# EAGLE design WeBee (EAGLE 7.1.0)

## Sheet 1 of 4
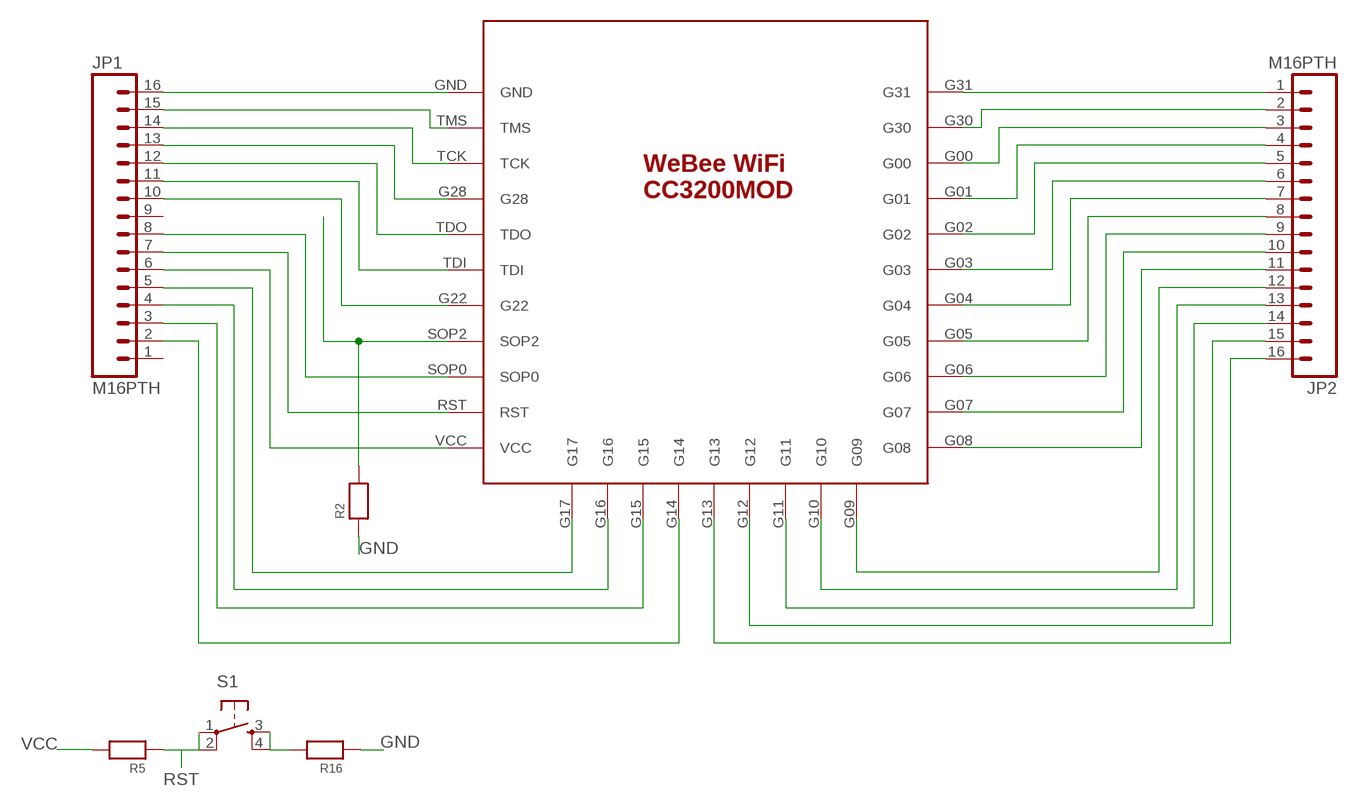
[diagram p0: schematic, sheet 1]

### Parts
JP1  M16PTH  [1X16]
JP2  M16PTH  [1X16]
R2  RESISTOR0402  [0402]
R5  RESISTOR0402  [0402]
R16  RESISTOR0402  [0402]
S1  TAC_SWITCHSMD  [TACTILE_SWITCH_SMD]
U$1  WEBEE_WIFI_CC3200  [CC3200]

### Nets
FTDI_RX: JP2.4 U$1.G01 ; also sheet 4
FTDI_TX: JP2.5 U$1.G02 ; also sheet 4
G00: JP2.3 U$1.G00
GND [vcc]: JP1.16 R2.1 R16.1 U$1.GND ; also sheet 2,3,4
N$1: R16.2 S1.3 S1.4
N$2: JP1.15 U$1.TMS
N$3: JP1.14 U$1.TCK
N$4: JP1.13 U$1.G28
N$5: JP1.12 U$1.TDO
N$6: JP1.11 U$1.TDI
N$7: JP1.10 U$1.G22
N$9: JP1.8 U$1.SOP0
N$12: JP2.1 U$1.G31
N$13: JP2.2 U$1.G30
N$17: JP2.6 U$1.G03
N$18: JP2.7 U$1.G04
N$19: JP2.8 U$1.G05
N$20: JP2.9 U$1.G06
N$21: JP2.10 U$1.G07
N$22: JP2.11 U$1.G08
N$23: JP2.12 U$1.G09
N$24: JP1.5 U$1.G17
N$25: JP2.13 U$1.G10
N$26: JP2.14 U$1.G11
N$27: JP2.15 U$1.G12
N$28: JP2.16 U$1.G13
N$29: JP1.4 U$1.G16
N$30: JP1.3 U$1.G15
N$31: JP1.2 U$1.G14
RST: JP1.7 R5.1 S1.2 U$1.RST ; also sheet 4
SOP2: R2.2 U$1.SOP2 ; also sheet 4
VCC: JP1.6 R5.2 U$1.VCC ; also sheet 3,4
Unconnected: JP1.1 JP1.9 S1.1

## Sheet 2 of 4
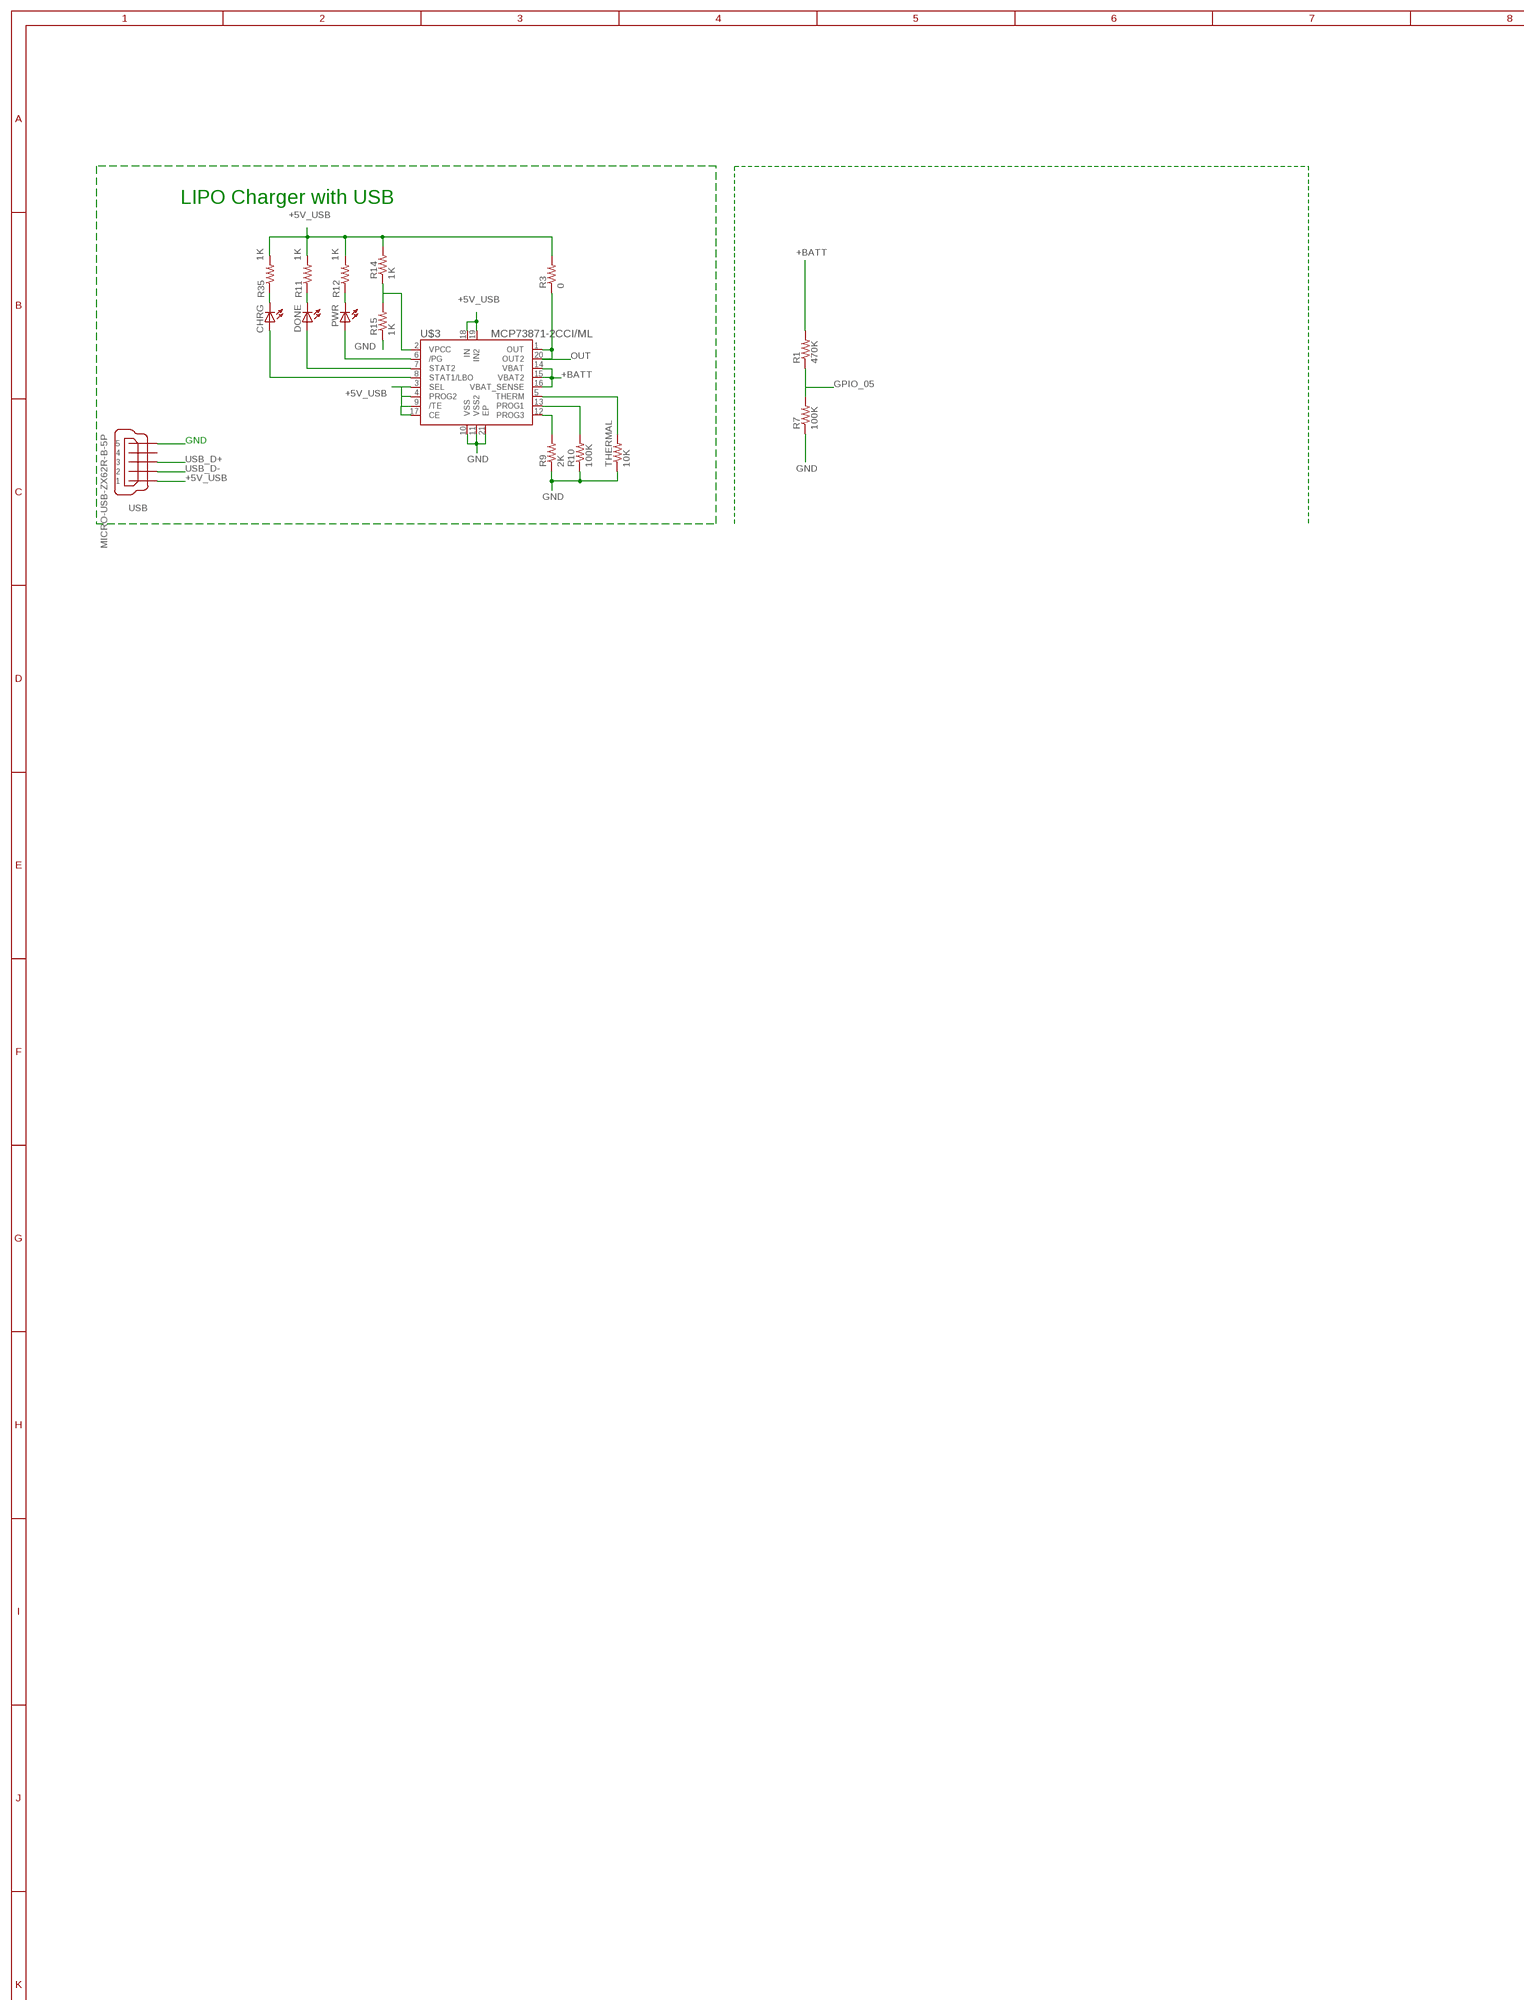
[diagram p1: schematic, sheet 2, part 1 of 3]
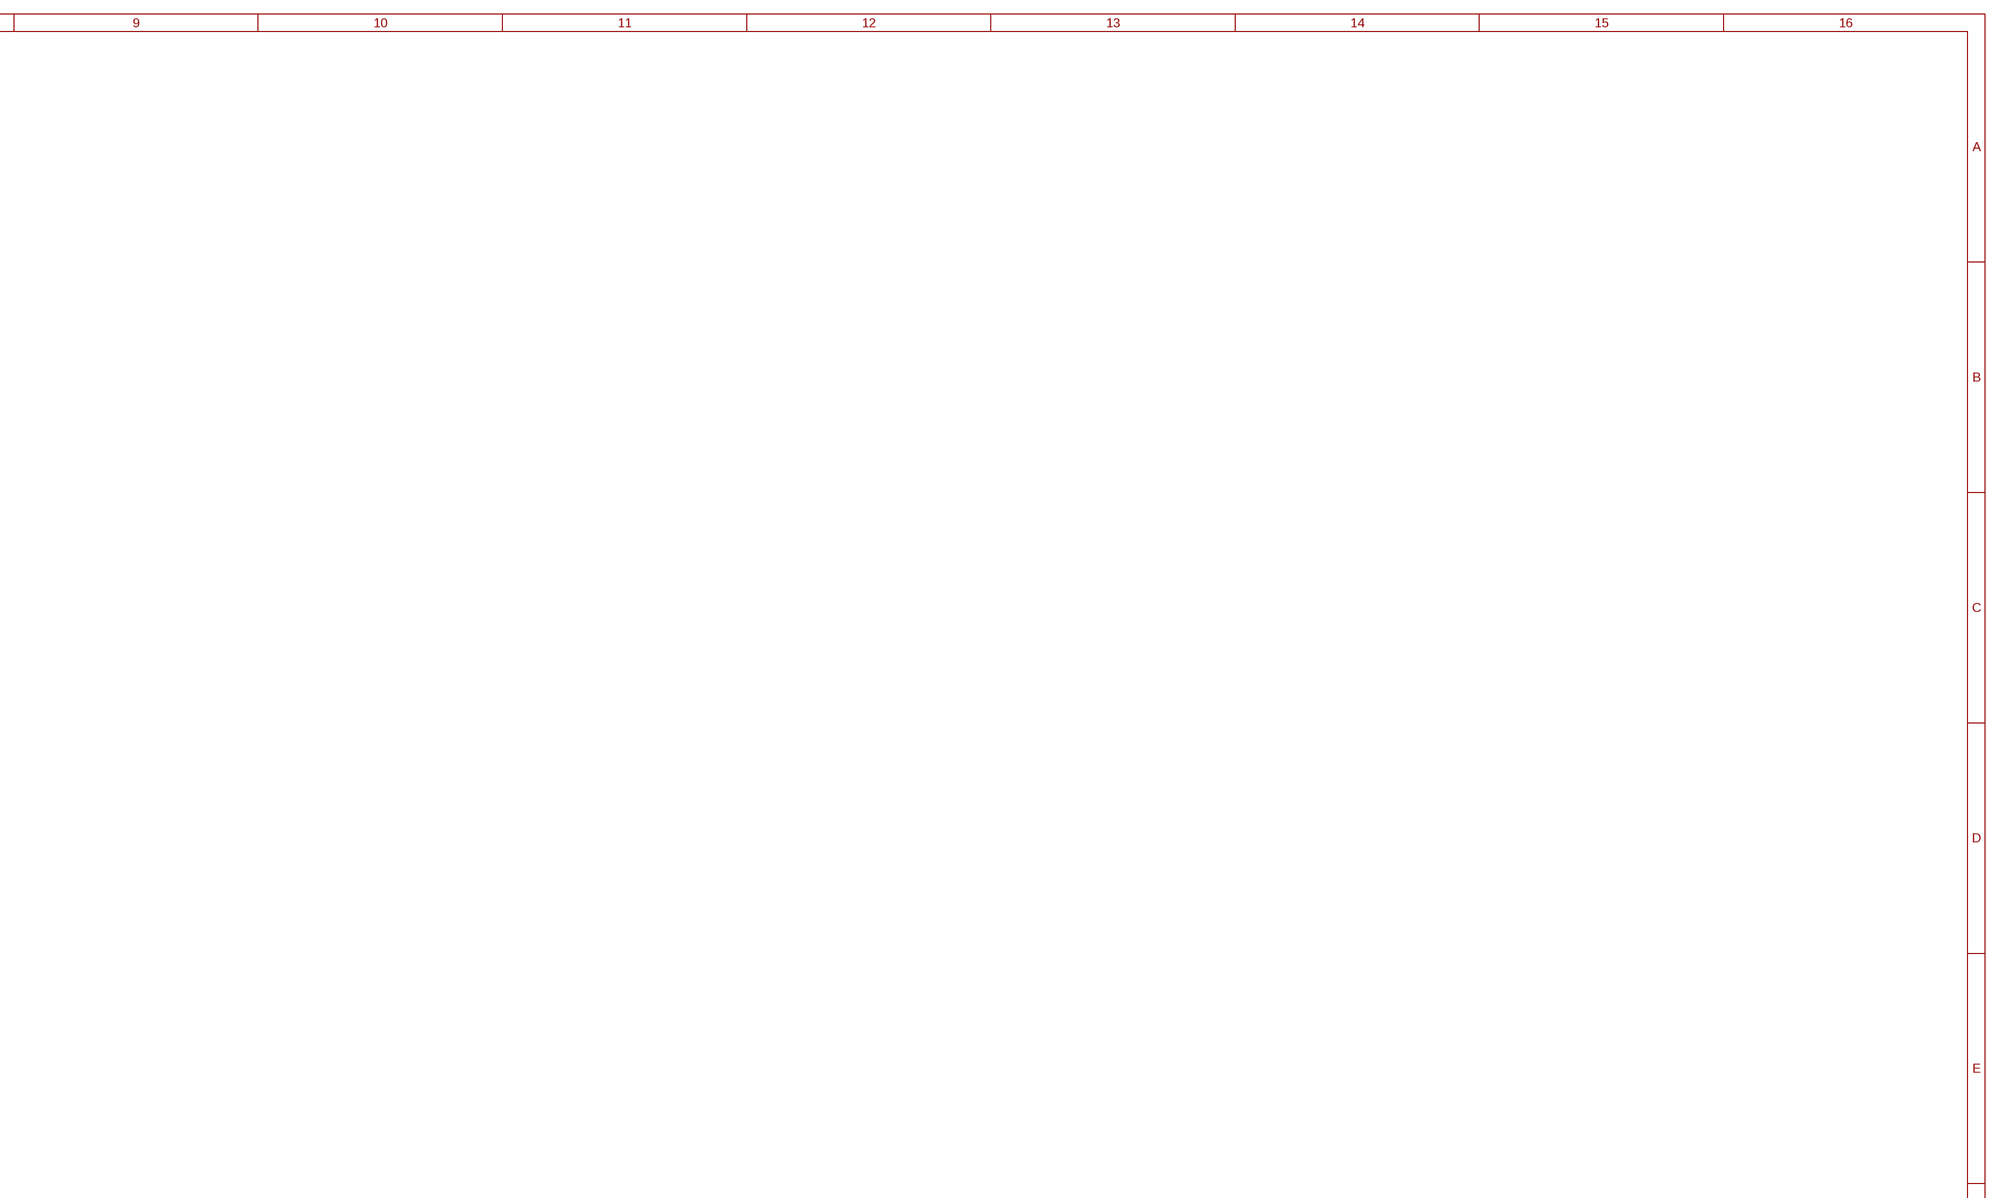
[diagram p2: schematic, sheet 2, part 2 of 3]
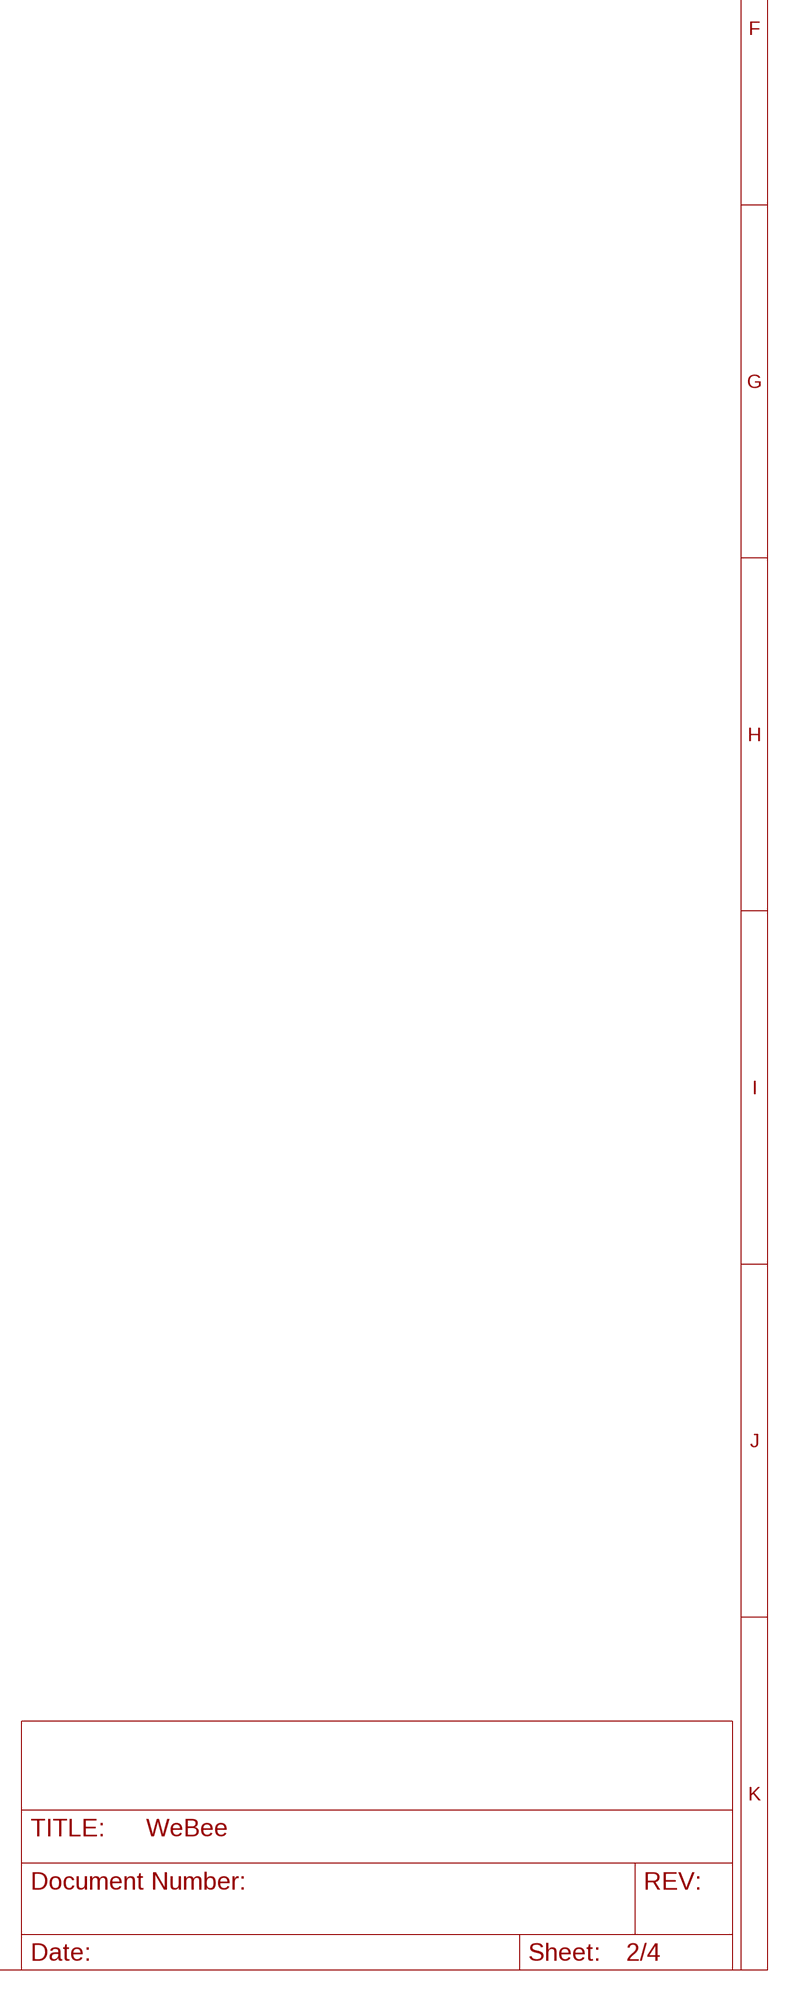
[diagram p3: schematic, sheet 2, part 3 of 3]

### Parts
CHRG  LEDSML0603  [SML0603]
DONE  LEDSML0603  [SML0603]
PWR  LEDSML0603  [SML0603]
R1  470K  RESISTOR0603  [0603-RES]
R3  0  RESISTOR0603-RES  [0603-RES]
R7  100K  RESISTOR0603  [0603-RES]
R9  2K  RESISTOR0603-RES  [0603-RES]
R10  100K  RESISTOR0603-RES  [0603-RES]
R11  1K  RESISTOR0402-RES  [0402-RES]
R12  1K  RESISTOR0402-RES  [0402-RES]
R14  1K  RESISTOR0603-RES  [0603-RES]
R15  1K  RESISTOR0603-RES  [0603-RES]
R35  1K  RESISTOR0402-RES  [0402-RES]
THERMAL  10K  RESISTOR0603-RES  [0603-RES]
U$3  MCP73871-2CCI/ML  [QFN20-4X4]
USB  MICRO-USB-ZX62R-B-5P  [ZX62R-B-5P]

### Nets
+5V_USB: R3.2 R11.2 R12.2 R14.2 R35.2 U$3.3(SEL) U$3.4(PROG2) U$3.9(/TE) U$3.17(CE) U$3.18(IN) U$3.19(IN2) USB.1 ; also sheet 4
+BATT: R1.2 U$3.14(VBAT) U$3.15(VBAT2) U$3.16(VBAT_SENSE) ; also sheet 3
GND [vcc]: R7.1 R9.1 R10.1 R15.1 THERMAL.1 U$3.10(VSS) U$3.11(VSS2) U$3.21(EP) USB.5 ; also sheet 1,3,4
GPIO_05: R1.1 R7.2
N$68: R9.2 U$3.12(PROG3)
N$69: R10.2 U$3.13(PROG1)
N$70: PWR.A U$3.6(/PG)
N$71: DONE.A U$3.7(STAT2)
N$72: CHRG.A U$3.8(STAT1/LBO)
N$73: CHRG.C R35.1
N$74: DONE.C R11.1
N$75: PWR.C R12.1
N$76: R14.1 R15.2 U$3.2(VPCC)
N$77: THERMAL.2 U$3.5(THERM)
OUT: R3.1 U$3.1(OUT) U$3.20(OUT2) ; also sheet 3
USB_D+: USB.3 ; also sheet 4
USB_D-: USB.2 ; also sheet 4
Unconnected: USB.4

### Notes on the sheet
- LIPO Charger with USB
- GND

## Sheet 3 of 4
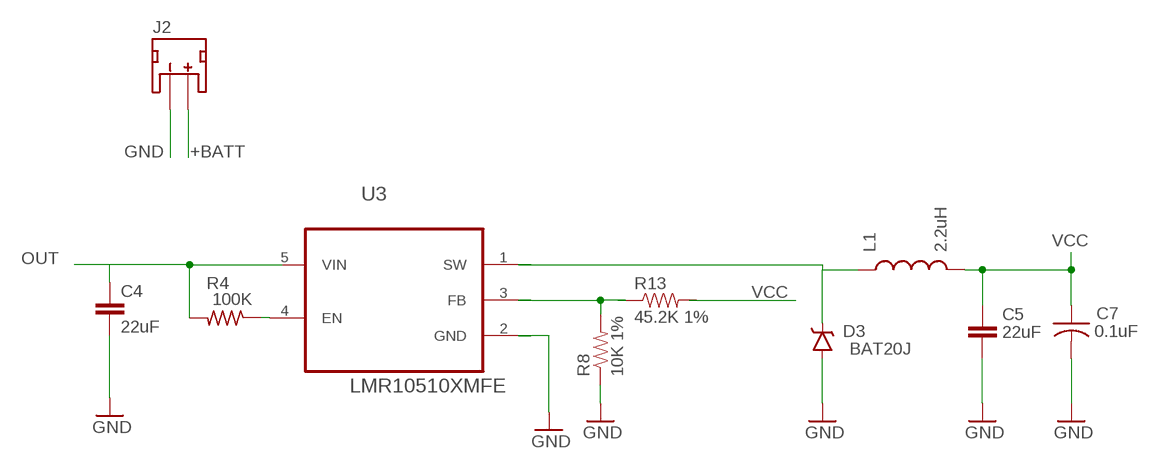
[diagram p4: schematic, sheet 3]

### Parts
C4  22uF  C-EUC0603  [C0603]
C5  22uF  C-EUC0603  [C0603]
C7  0.1uF  C-USC0402  [C0402]
D3  BAT20J  DIODE-SCHOTTKY-BAT20J  [SOD-323]
J2  JST_2MM_MALE  [JST-2-SMD]
L1  2.2uH  INDUCTOR-SPARKFUN0805  [0805]
R4  100K  R-US_R0402  [R0402]
R8  10K 1%  RESISTOR0402-RES  [0402-RES]
R13  45.2K 1%  RESISTOR0402-RES  [0402-RES]
U3  LMR10510XMFE  [SOT95P270X145-5N]

### Nets
+BATT: J2.2(+) ; also sheet 2
FB: R8.2 R13.1 U3.3(FB)
GND [vcc]: C4.2 C5.2 C7.2 D3.A J2.1(-) R8.1 U3.2(GND) ; also sheet 1,2,4
N$11: R4.1 U3.4(EN)
OUT: C4.1 R4.2 U3.5(VIN) ; also sheet 2
SW: D3.C L1.1 U3.1(SW)
VCC: C5.1 C7.1 L1.2 R13.2 ; also sheet 1,4
Unconnected: J2.NC1(PAD1) J2.NC2(PAD2)

## Sheet 4 of 4
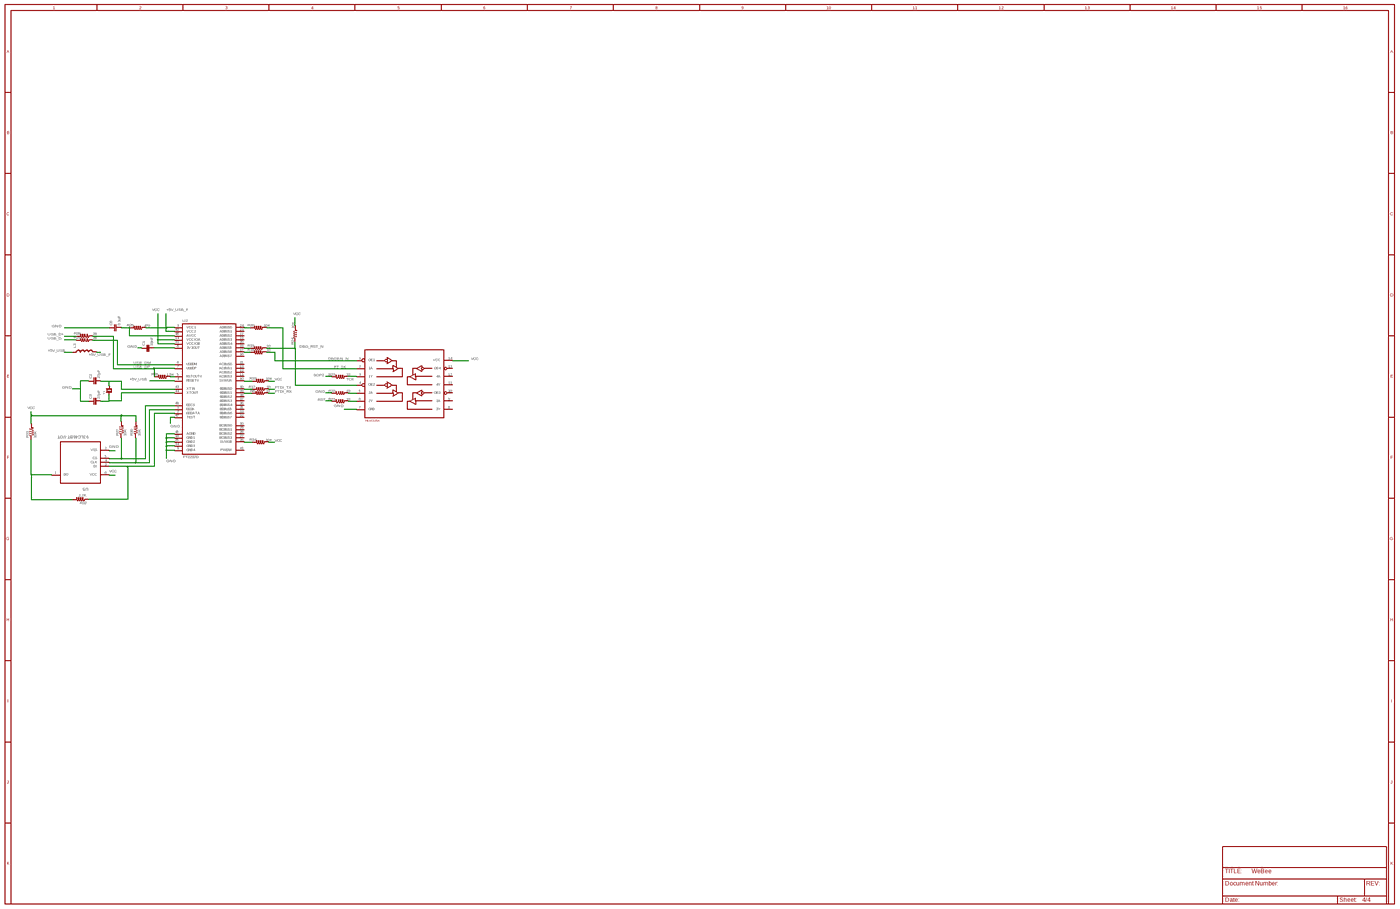
[diagram p5: schematic, sheet 4, overview]
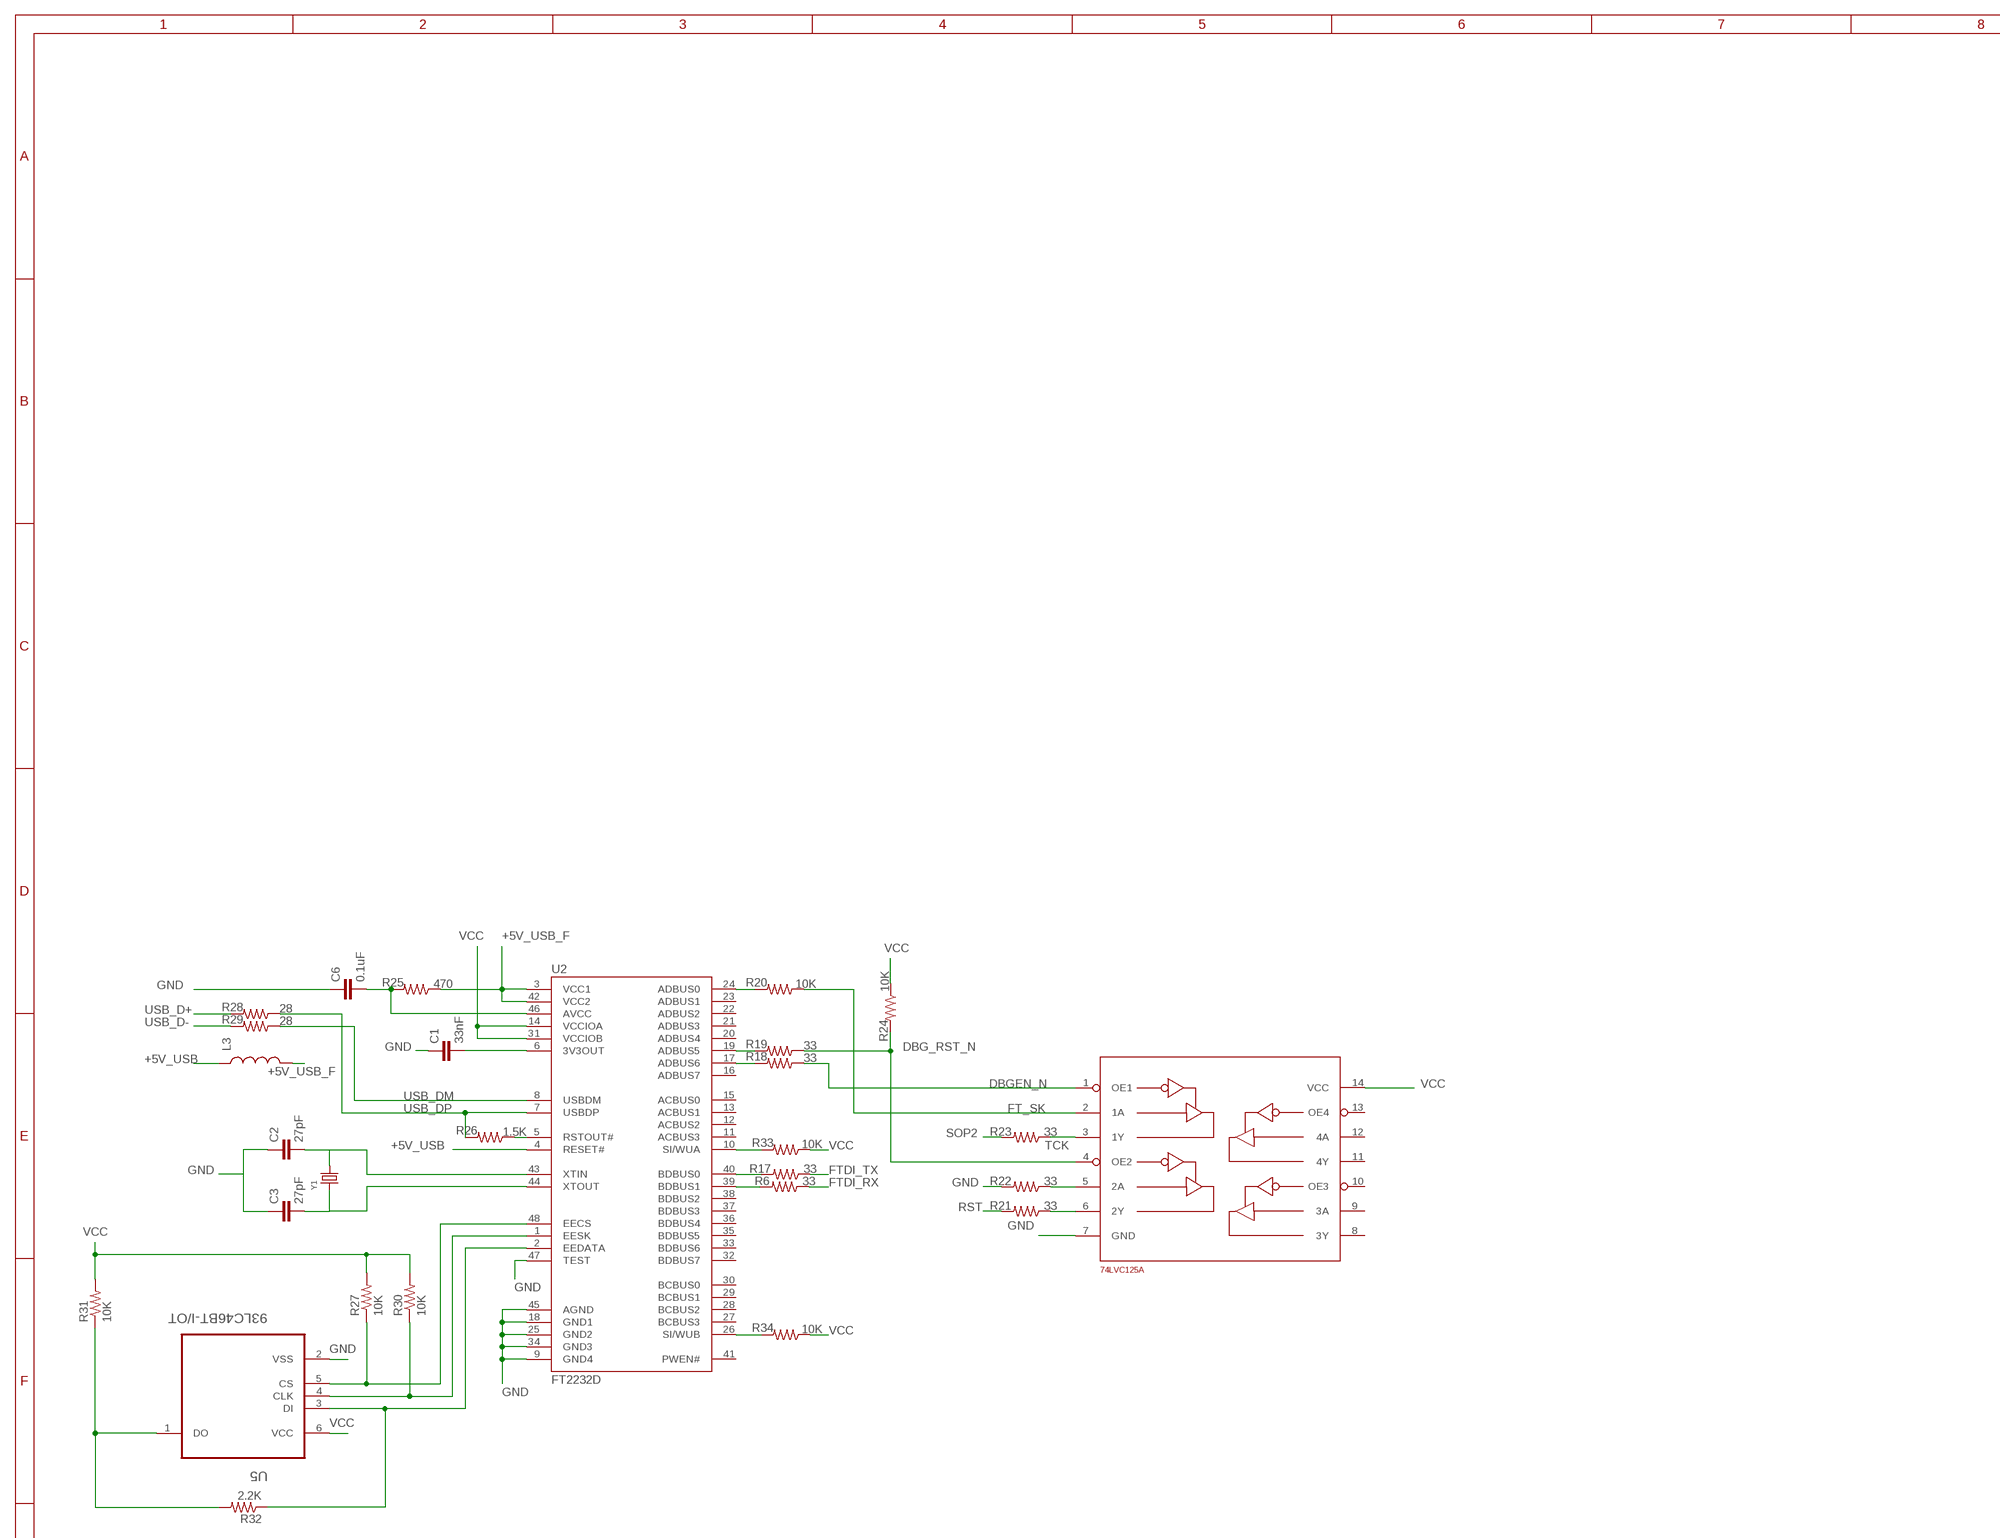
[diagram p6: schematic, sheet 4, part 1 of 4]
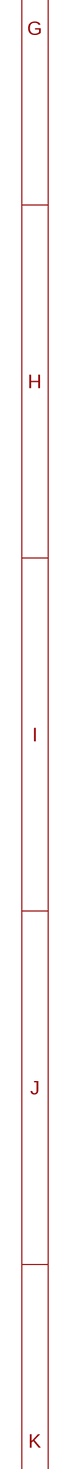
[diagram p7: schematic, sheet 4, part 2 of 4]
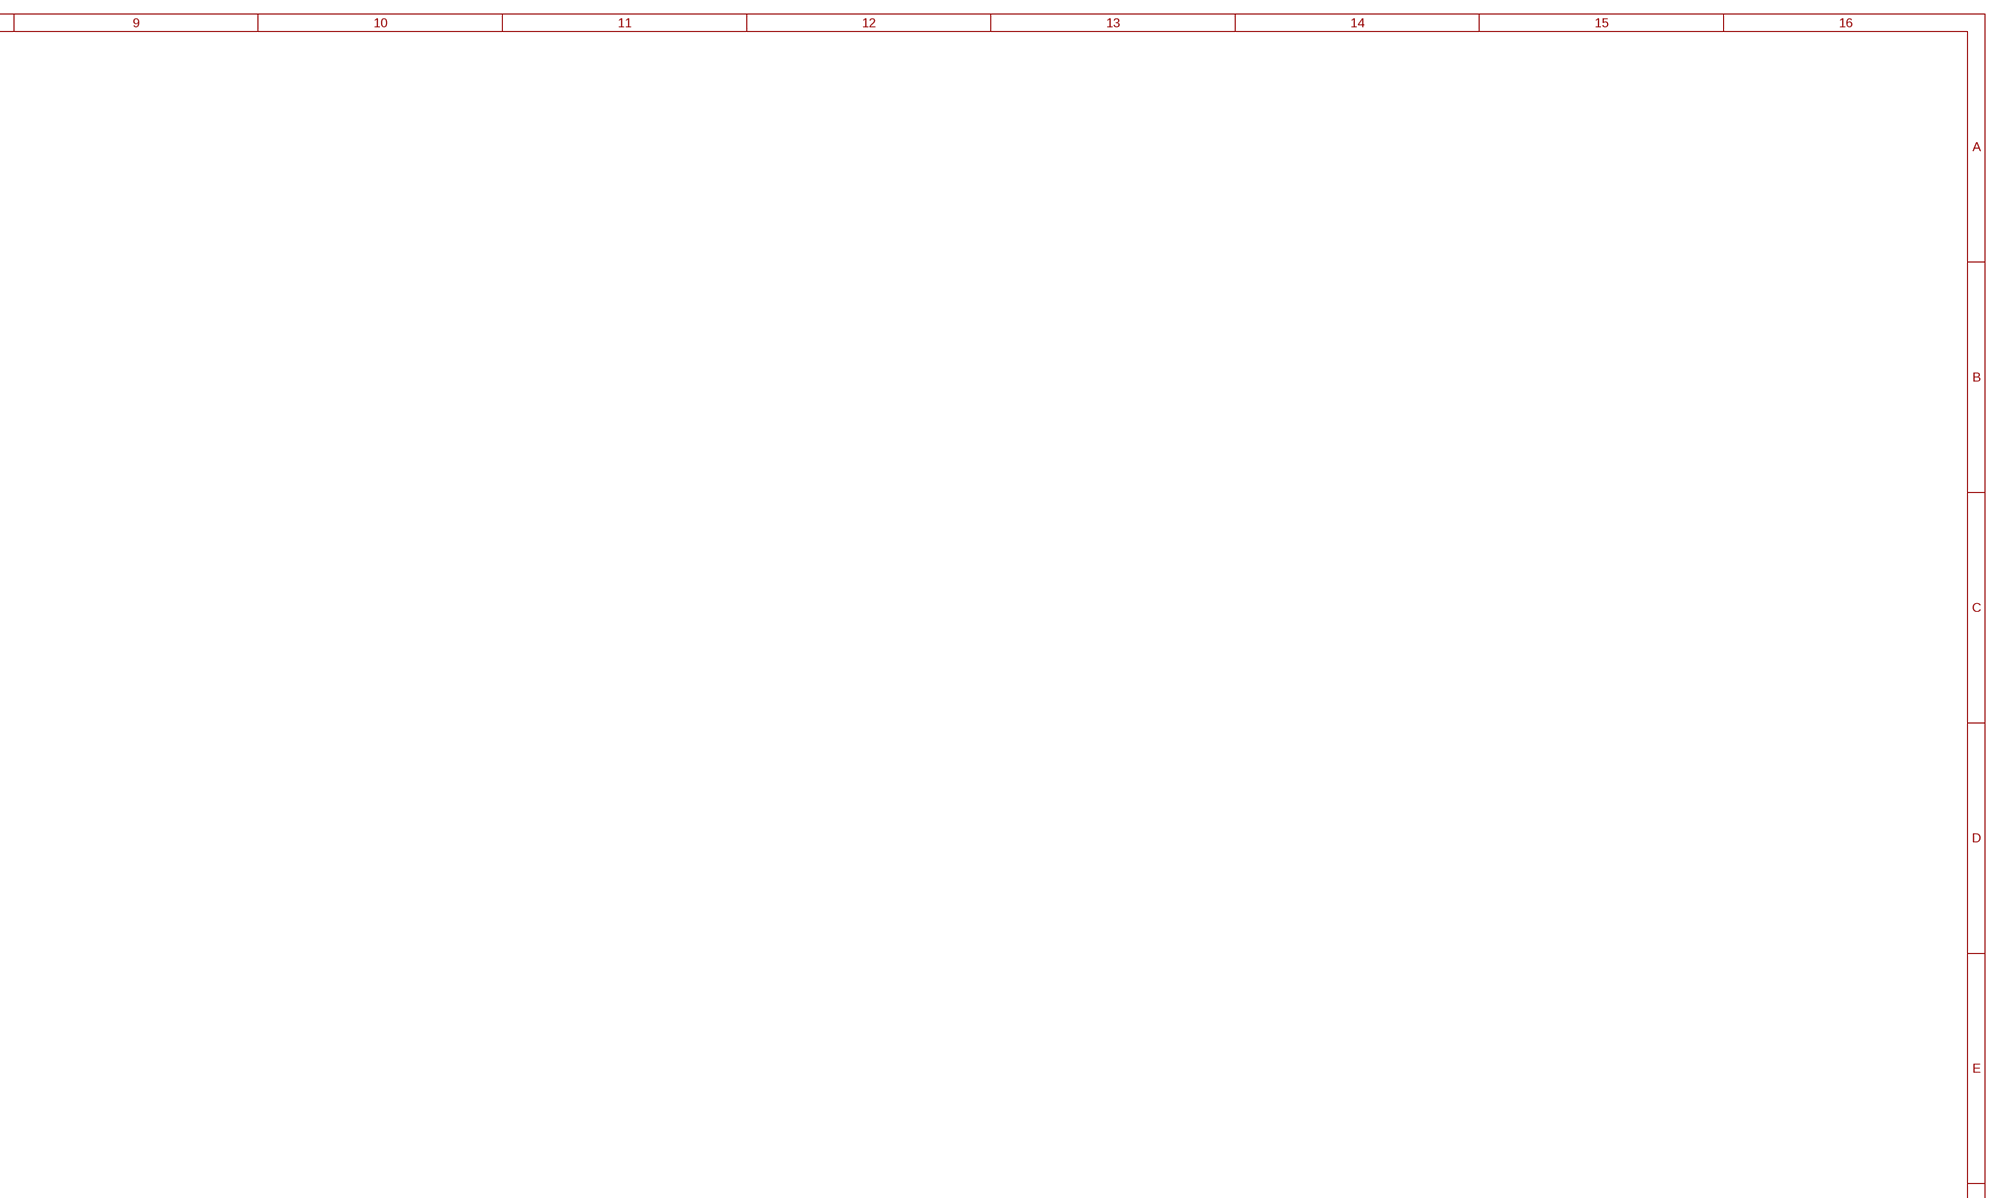
[diagram p8: schematic, sheet 4, part 3 of 4]
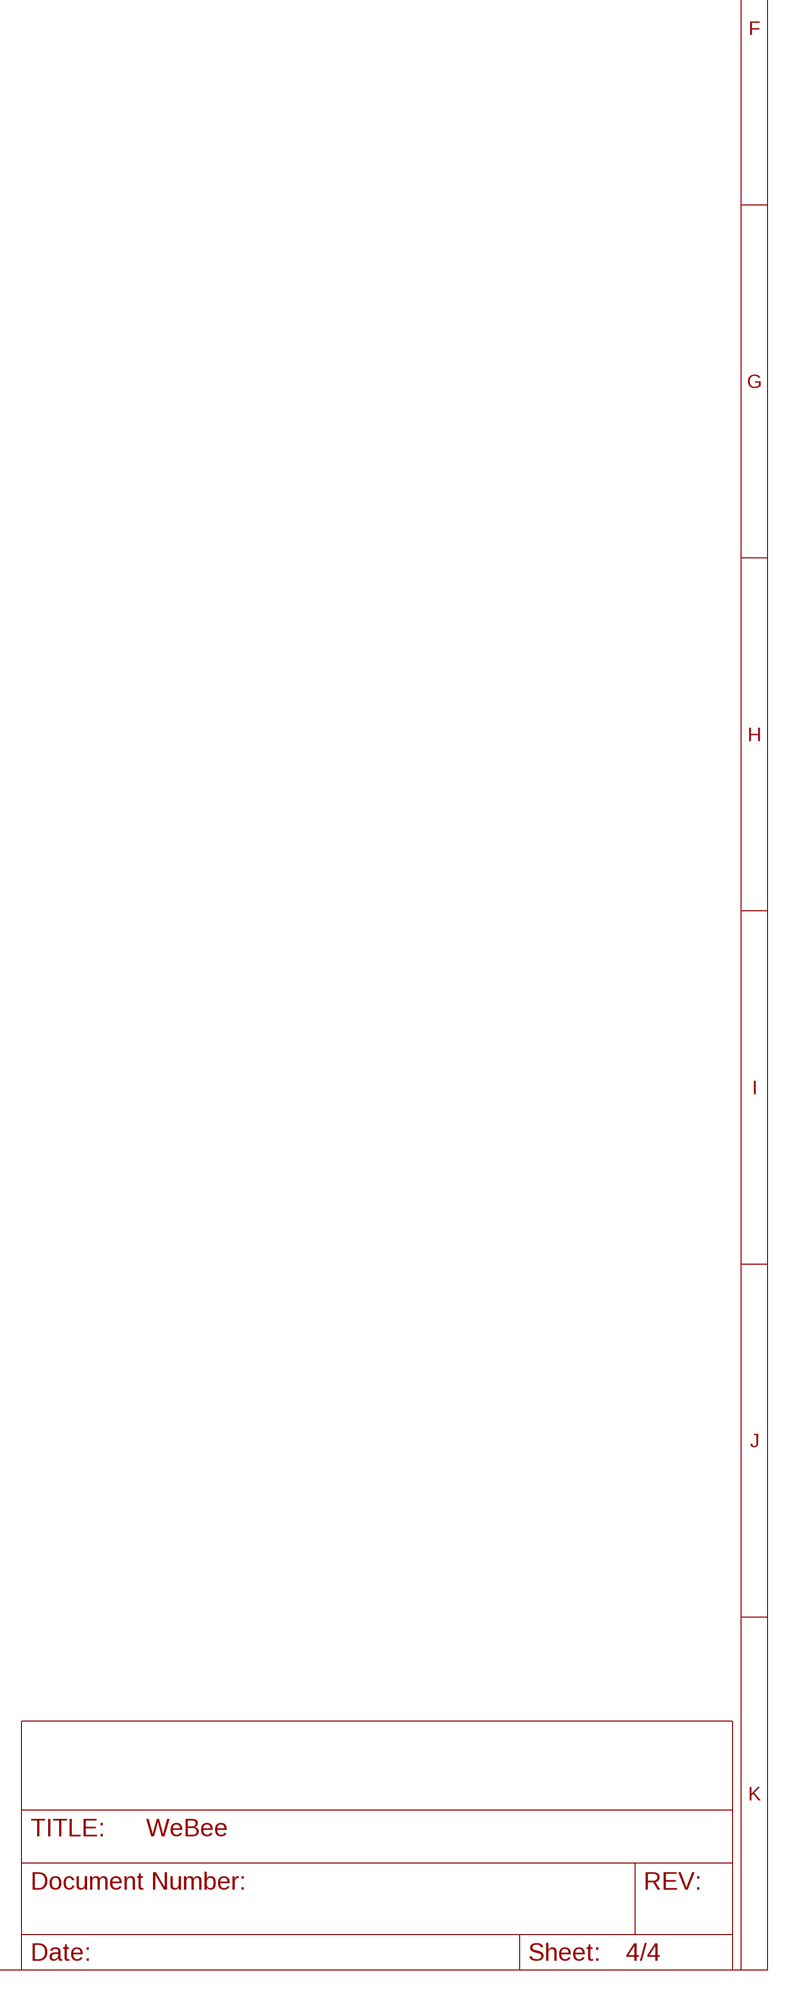
[diagram p9: schematic, sheet 4, part 4 of 4]

### Parts
C1  33nF  CAP0402-CAP  [0402-CAP]
C2  27pF  CAP0402-CAP  [0402-CAP]
C3  27pF  CAP0402-CAP  [0402-CAP]
C6  0.1uF  CAP0402-CAP  [0402-CAP]
L3  INDUCTOR-SPARKFUN0603  [0603]
R6  33  RESISTOR0402-RES  [0402-RES]
R17  33  RESISTOR0402-RES  [0402-RES]
R18  33  RESISTOR0402-RES  [0402-RES]
R19  33  RESISTOR0402-RES  [0402-RES]
R20  10K  RESISTOR0402-RES  [0402-RES]
R21  33  RESISTOR0402-RES  [0402-RES]
R22  33  RESISTOR0402-RES  [0402-RES]
R23  33  RESISTOR0402-RES  [0402-RES]
R24  10K  RESISTOR0402-RES  [0402-RES]
R25  470  RESISTOR0402-RES  [0402-RES]
R26  1.5K  RESISTOR0402-RES  [0402-RES]
R27  10K  RESISTOR0402-RES  [0402-RES]
R28  28  RESISTOR0402-RES  [0402-RES]
R29  28  RESISTOR0402-RES  [0402-RES]
R30  10K  RESISTOR0402-RES  [0402-RES]
R31  10K  RESISTOR0402-RES  [0402-RES]
R32  2.2K  RESISTOR0402-RES  [0402-RES]
R33  10K  RESISTOR0402-RES  [0402-RES]
R34  10K  RESISTOR0402-RES  [0402-RES]
U2  FT2232D  [LQFP-48]
U5  93LC46BT-I/OT  [SOT95P280X145-6N]
U$4  DECADE-74LVC125A  [DECADE-SO-14]
Y1  CRYSTAL2.5X2.0MM  [CRYSTAL_2.5X2]

### Nets
+5V_USB: L3.1 U2.4(RESET#) ; also sheet 2
+5V_USB_F: L3.2 R25.1 U2.3(VCC1) U2.42(VCC2)
DBG_RST_N: R19.1 R24.2 U$4.4(OE2)
DBGEN_N: R18.1 U$4.1(OE1)
FT_SK: R20.1 U$4.2(1A)
FTDI_RX: R6.1 ; also sheet 1
FTDI_TX: R17.1 ; also sheet 1
GND [vcc]: C1.1 C2.1 C3.1 C6.1 R22.2 U2.9(GND4) U2.18(GND1) U2.25(GND2) U2.34(GND3) U2.45(AGND) U2.47(TEST) U5.2(VSS) U$4.7(GND) ; also sheet 1,2,3
N$8: R26.1 U2.5(RSTOUT#)
N$38: C2.2 U2.43(XTIN) Y1.3
N$39: R27.1 U2.48(EECS) U5.5(CS)
N$40: C3.2 U2.44(XTOUT) Y1.1
N$41: R30.1 U2.1(EESK) U5.4(CLK)
N$42: R32.1 U2.2(EEDATA) U5.3(DI)
N$43: C1.2 U2.6(3V3OUT)
N$44: R17.2 U2.40(BDBUS0)
N$45: R6.2 U2.39(BDBUS1)
N$46: R20.2 U2.24(ADBUS0)
N$47: R19.2 U2.19(ADBUS5)
N$48: R18.2 U2.17(ADBUS6)
N$49: R22.1 U$4.5(2A)
N$50: R21.1 U$4.6(2Y)
N$51: C6.2 R25.2 U2.46(AVCC)
N$54: R31.1 R32.2 U5.1(DO)
N$55: R33.2 U2.10(SI/WUA)
N$56: R34.2 U2.26(SI/WUB)
RST: R21.2 ; also sheet 1
SOP2: R23.2 ; also sheet 1
TCK: R23.1 U$4.3(1Y)
USB_D+: R28.2 ; also sheet 2
USB_D-: R29.2 ; also sheet 2
USB_DM: R29.1 U2.8(USBDM)
USB_DP: R26.2 R28.1 U2.7(USBDP)
VCC: R24.1 R27.2 R30.2 R31.2 R33.1 U2.14(VCCIOA) U2.31(VCCIOB) U5.6(VCC) U$4.14(VCC) ; also sheet 1,3
Unconnected: R34.1 U2.11(ACBUS3) U2.12(ACBUS2) U2.13(ACBUS1) U2.15(ACBUS0) U2.16(ADBUS7) U2.20(ADBUS4) U2.21(ADBUS3) U2.22(ADBUS2) U2.23(ADBUS1) U2.27(BCBUS3) U2.28(BCBUS2) U2.29(BCBUS1) U2.30(BCBUS0) U2.32(BDBUS7) U2.33(BDBUS6) U2.35(BDBUS5) U2.36(BDBUS4) U2.37(BDBUS3) U2.38(BDBUS2) U2.41(PWEN#) U$4.8(3Y) U$4.9(3A) U$4.10(OE3) U$4.11(4Y) U$4.12(4A) U$4.13(OE4)

## Library data of the parts
C1-C3 C6 = SparkFun-Passives:CAP: Capacitor Standard 0603 ceramic capacitor, and 0.1" leaded capacitor.
C4 C5 = rcl:C-EU: CAPACITOR, European symbol
C7 = adafruit:C-US: CAPACITOR, American symbol
CHRG DONE PWR = led:LED: LED OSRAM: - CHIPLED LG R971, LG N971, LY N971, LG Q971, LY Q971, LO R971, LY R971 LH N974, LH R974 LS Q976, LO Q976, LY Q976 LO Q996 - Hyper CHIPLED LW Q18S LB Q993, LB Q99A, LB R99A - SideLED LS A670, LO A670, LY A670, LG A670, LP A670 LB A673, LV A673, LT A673, LW A673 LH A674 LY A675 LS A676, LA A676, LO A676, LY A676, LW A676 LS A679, LY A679, LG A679 - Hyper Micro SIDELED® LS Y876, LA Y876, LO Y876, LY Y876 LT Y87S - SmartLED LW L88C, LW L88S LB L89C, LB L89S, LG L890 LS L89K, LO L89K, LY L89K LS L896, LA L896, LO L896, LY L896 - TOPLED LS T670, LO T670, LY T670, LG T670, LP T670 LSG T670, LSP T670, LSY T670, LOP T670, LYG T670 LG T671, LOG T671, LSG T671 LB T673, LV T673, LT T673, LW T673 LH T674 LS T676, LA T676, LO T676, LY T676, LB T676, LH T676, LSB T676, LW T676 LB T67C, LV T67C, LT T67C, LS T67K, LO T67K, LY T67K, LW E67C LS E67B, LA E67B, LO E67B, LY E67B, LB E67C, LV E67C, LT E67C LW T67C LS T679, LY T679, LG T679 LS T770, LO T770, LY T770, LG T770, LP T770 LB T773, LV T773, LT T773, LW T773 LH T774 LS E675, LA E675, LY E675, LS T675 LS T776, LA T776, LO T776, LY T776, LB T776 LHGB T686 LT T68C, LB T68C - Hyper Mini TOPLED® LB M676 - Mini TOPLED Santana® LG M470 LS M47K, LO M47K, LY M47K Source: http://www.osram.convergy.de LUXEON: - LUMILED® LXK2-PW12-R00, LXK2-PW12-S00, LXK2-PW14-U00, LXK2-PW14-V00 LXK2-PM12-R00, LXK2-PM12-S00, LXK2-PM14-U00 LXK2-PE12-Q00, LXK2-PE12-R00, LXK2-PE12-S00, LXK2-PE14-T00, LXK2-PE14-U00 LXK2-PB12-K00, LXK2-PB12-L00, LXK2-PB12-M00, LXK2-PB14-N00, LXK2-PB14-P00, LXK2-PB14-Q00 LXK2-PR12-L00, LXK2-PR12-M00, LXK2-PR14-Q00, LXK2-PR14-R00 LXK2-PD12-Q00, LXK2-PD12-R00, LXK2-PD12-S00 LXK2-PH12-R00, LXK2-PH12-S00 LXK2-PL12-P00, LXK2-PL12-Q00, LXK2-PL12-R00 Source: www.luxeon.com KINGBRIGHT: KA-3528ASYC Source: www.kingbright.com
D3 = SparkFun-DiscreteSemi:DIODE-SCHOTTKY: Schottky diodes in SFE's production catalog BAT20J 1A 23V 0.62Vf RB751 120mA 40V 0.37Vf PMEG4005EJ 0.5A 40V 0.42Vf MBRA140 1A 40V 0.5Vf B340A 3A 40V SMA; PROD_ID: DIO-11623
J2 = SparkFun-Connectors:JST_2MM_MALE: Mates to single-cell LiPo batteries. CONN-08352; PROD_ID: CONN-08352
JP1 JP2 = DECADE-libraries:M16: 1x16 .1" header
L1 L3 = Spark:INDUCTOR-SPARKFUN: Inductors Basic Inductor/Choke - 0603 and 1206. Footprints are not proven and vary greatly between part numbers. SRN6045- 33uH, 20% 1.4A
R1 R7 = SparkFun-Resistors:RESISTOR: Resistor Basic schematic elements and footprints for 0603, 1206, and PTH resistors.
R2 R5 R16 = microbuilder:RESISTOR: Resistors 0402 - 0402 Surface Mount Package 22 Ohm 1% 1/16W [Digikey: 311-22.0LRTR-ND] 33 Ohm 5% 1/16W 1.0K 5% 1/16W 1.5K 5% 1/16W 2.0K 1% 1/16W 10.0K 1% 1/16W [Digikey: 311-10.0KLRTR-ND] 10.0K 5% 1/16W [Digikey: RMCF0402JT10K0TR-ND] 12.1K 1% 1/16W [Digikey: 311-22.0LRTR-ND] 100.0K 5% 1/16W 0603 - 0603 Surface Mount Package 0 Ohm 1/10 Watt 1% Resistor 15 Ohm 1/10 Watt 1% Resistor 33 Ohm 1/10 Watt 1% Resistor 49.9 Ohm 1/10 Watt 1% Resistor 100 Ohm 1/10 Watt 1% Resistor 150 Ohm 1/10 Watt 1% Resistor 240 Ohm 1/10 Watt 1% Resistor 390 Ohm 1/10 Watt 1% Resistor 560 Ohm 1/10 Watt 1% Resistor 680 Ohm 1/10 Watt 1% Resistor 750 Ohm 1/10 Watt 1% Resistor 1.0K Ohm 1/10 Watt 1% Resistor 1.5K Ohm 1/10 Watt 1% Resistor 2.0K Ohm 1/10 Watt 1% Resistor 2.2K Ohm 1/10 Watt 1% Resistor 3.3K Ohm 1/10 Watt 1% Resistor 4.7K Ohm 1/10 Watt 1% Resistor 10.0K Ohm 1/10 Watt 1% Resistor 12.0K Ohm 1/10 Watt 1% Resistor 12.1K Ohm 1/10 Watt 1% Resistor 20.0K Ohm 1/10 Watt 1% Resistor 33.0K Ohm 1/10 Watt 1% Resistor 100.0K Ohm 1/10 Watt 1% Resistor 0805 - 0805 Surface Mount Package 0 Ohm 1/8 Watt 1% Resistor 33 Ohm 1/8 Watt 1% Resistor 100 Ohm 1/8 Watt 1% Resistor 150 Ohm 1/8 Watt 1% Resistor 200 Ohm 1/8 Watt 1% Resistor 240 Ohm 1/8 Watt 1% Resistor 330 Ohm 1/8 Watt 1% Resistor 390 Ohm 1/8 Watt 1% Resistor 470 Ohm 1/8 Watt 1% Resistor 1.0K Ohm 1/8 Watt 1% Resistor 1.5K Ohm 1/8 Watt 1% Resistor 2.0K Ohm 1/8 Watt 1% Resistor 4.7K Ohm 1/8 Watt 1% Resistor 5.1K Ohm 1/8 Watt 1% Resistor 5.6K Ohm 1/8 Watt 1% Resistor 10.0K Ohm 1/8 Watt 1% Resistor 22.0K Ohm 1/8 Watt 1% Resistor 33.0K Ohm 1/8 Watt 1% Resistor 100K Ohm 1/8 Watt 1% Resistor 1206 - 1206 Surface Mount Package 2012 - 2010 Surface Mount Package 0.11 Ohm 1/2 Watt 1% Resistor - Digikey: RHM.11UCT-ND
R3 R6 R8-R15 R17-R35 THERMAL = SparkFun-Passives:RESISTOR: Resistor Basic schematic elements and footprints for 0603, 1206, and PTH resistors.
R4 = adafruit:R-US_: RESISTOR, American symbol
S1 = Spark:TAC_SWITCH: SMD Tactiile Switch
U2 = SparkFun-DigitalIC:FT2232D: USB to USART/FIFO/JTAG/SPI/I2C
U3 = Microchip_By_element14_Batch_1:LMR10510XMFE
U5 = Microchip_By_element14_Batch_1:93LC46BT-I/OT: 1K Microwire Compatible Serial EEPROM; MPN: 93LC46BT-I/OT; OC_FARNELL: 1556164; OC_NEWARK: 75M3689; PACKAGE: SOT-6; SUPPLIER: Microchip
U$1 = WeeBee:WEBEE_WIFI_CC3200
U$3 = microchip-battery:MCP73871: Stand-Alone System Load Sharing and Li-Ion / Li-Polymer Battery Charge Managemen The MCP73871 device is a 1A fully integrated linear solution for system load sharing and Li-Ion / Li-Polymer battery charge management with AC-DC wall adapter and USB port power sources selection. It?s also capable of autonomous power source selection between input or battery. The MCP73871 device employs a constant current/constant voltage (CC/CV) charge algorithm with selectable charge termination point. The constant voltage regulation is fixed with four available options: 4.10V, 4.20V, 4.35V, or 4.40V.; LBO: 3.1 V; SAFETYTIMER: 6 Hours; VREG: 4.20V
U$4 = DECADE-libraries:DECADE-74LVC125A
USB = con-hirose:MICRO-USB-: Hirose Micro USB Connector ZX62R-B-5P: Micro B, reverse (top mount) shell SMT Supplier: DigiKey H11574CT-ND Source: http://www.hirose.co.jp/cataloge_hp/e24200011.pdf
Y1 = microbuilder:CRYSTAL: Crystals HC49UP - Surface Mount Crystal 4.0MHz 18pF +/-30ppm Surface Mount Crystal [Digikey: 535-9857-1-ND] 12.0 MHz Surface Mount Crystal [Digikey: 535-9869-6-ND] 25.0 MHz Surface Mount Crystal [Digikey: 535-9078-1-ND] 2.5 x 2.0mm - MEMs SMT Crystal 16.0 MHz 10pF 20ppm 2.5 x 2.0mm Crystal [Digikey -40-85°C: 535-10923-1-ND] 3.2 x 2.5mm - MEMs SMT Crystal 12.0 MHz 8pF 15ppm 3.2 x 2.5mm Crystal [Digikey: -10-70°C: 644-1047-1-ND -40-125°C: 644-1128-1-ND] 16.0 MHz 8pF 15ppm 3.2 x 2.5mm Crystal [Digikey: -10-70°C: 644-1049-1-ND -40-125°C: 644-1129-2-ND] 16.0 MHz 10pF 10ppm 3.2 x 2.5mm Crystal [Digikey: 644-1100-1-ND] 27.12 MHz 18pF 30ppm 3.2 x 2.5mm Crystal [Digikey: 887-1424-1-ND] 27.12MHz 10pF 10ppm 3.2 x 2.5mm Crystal [Digikey: 887-1329-1-ND] 4.9 x 1.8mm - MEMs SMT Crystal 32.768 KHz 12.5pF 20ppm 4.9 x 1.8mm Crystal [Digikey: SE2415CT-ND] 8.0 x 3.8mm - Surface Mount Crystal 32.768kHz 12.5pF 20ppm -40°C-85°C [Digikey: 535-9166-2-ND] Cylinder 32.768KHz Cylinder Crystal (2x6mm body) [Ex. Digikey: 300-8341-2-ND]

## Board
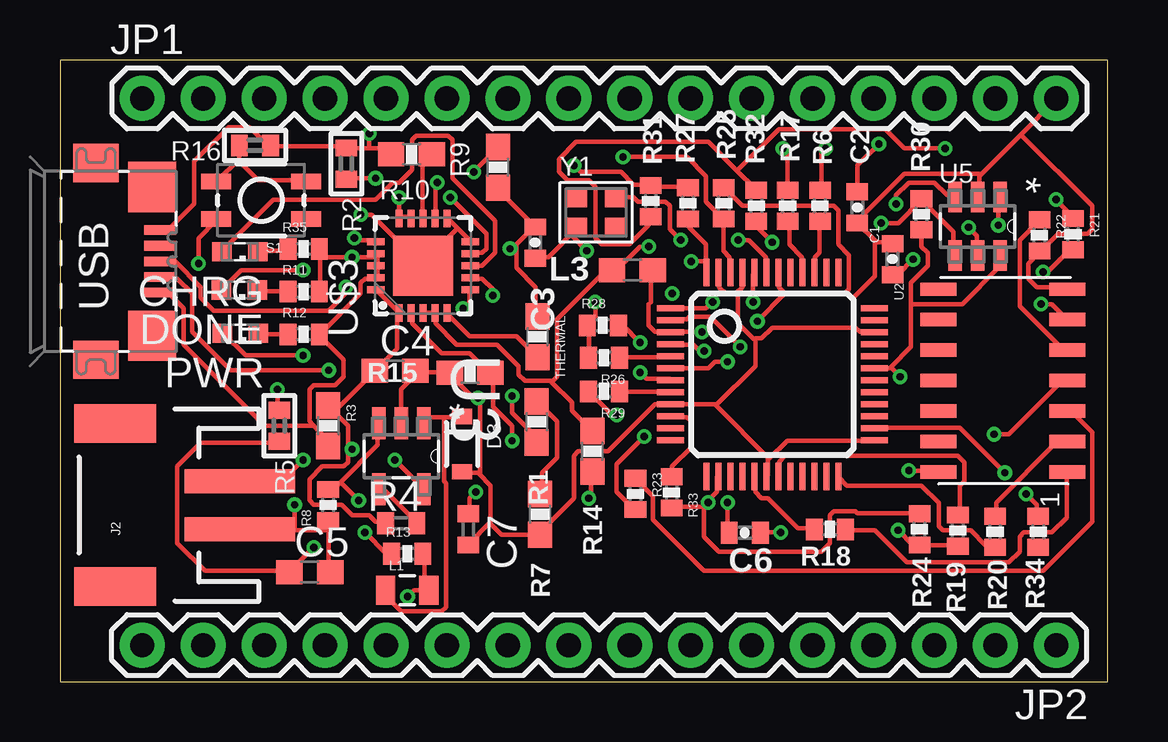
[diagram p10: board, top side]
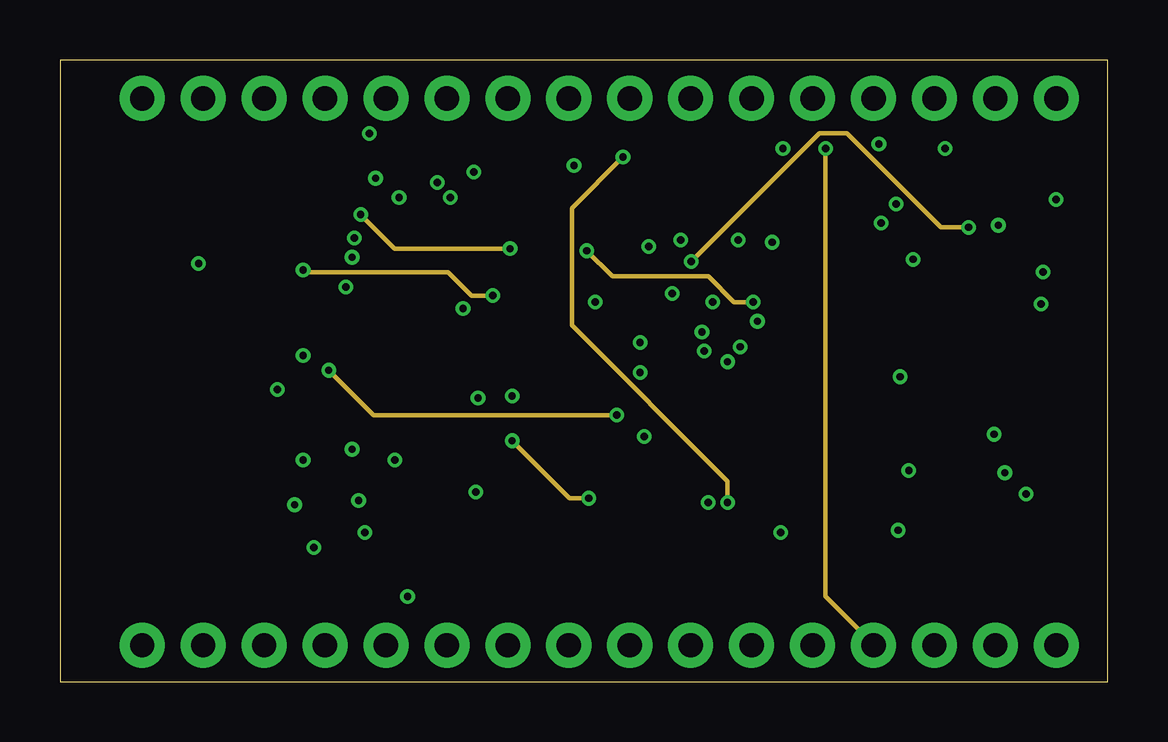
[diagram p11: board, inner layer Route2]
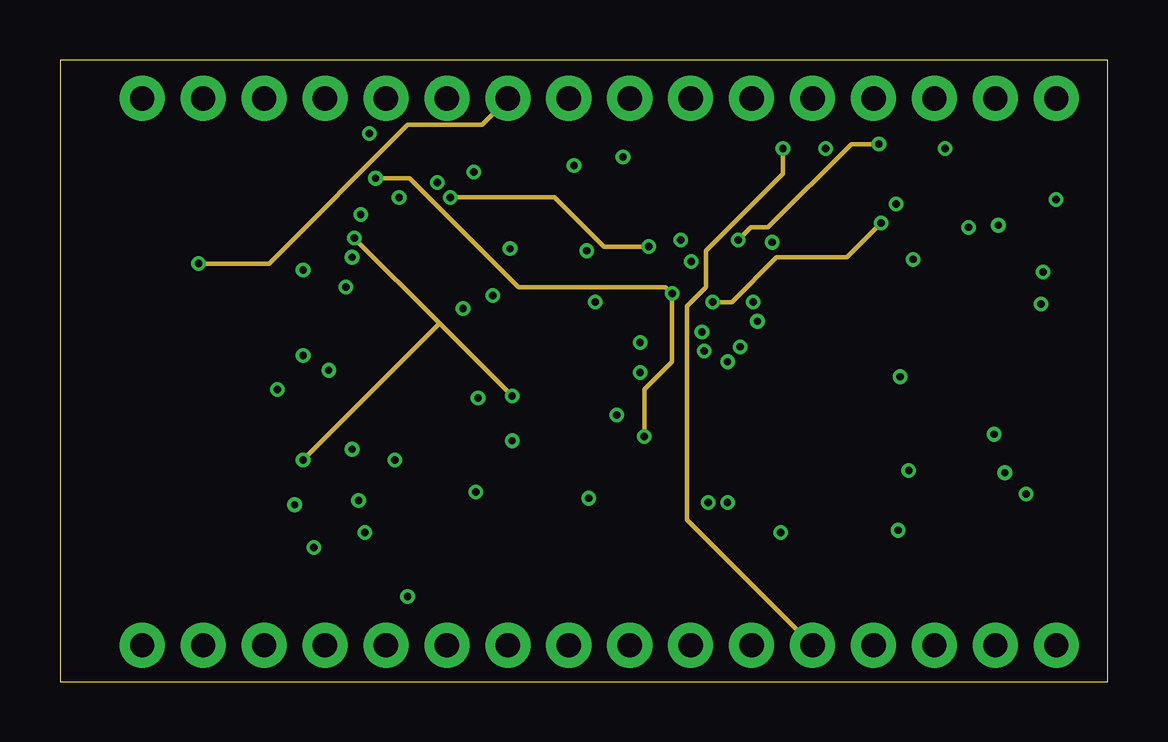
[diagram p12: board, inner layer Route15]
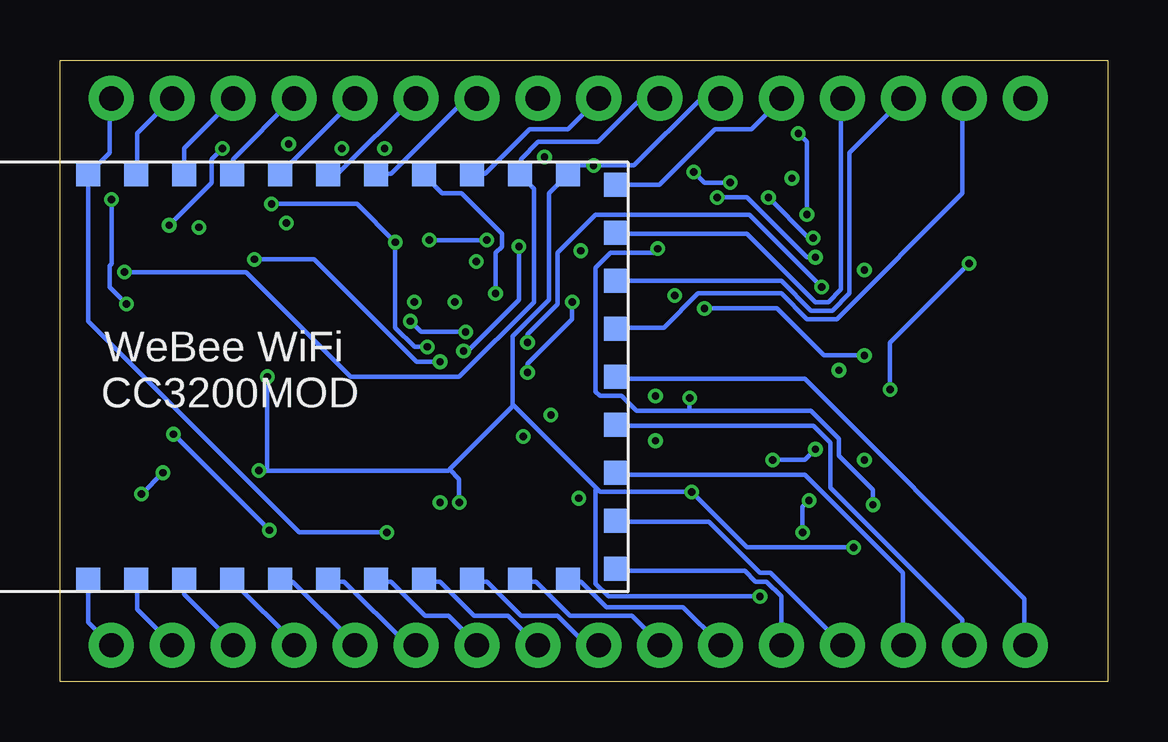
[diagram p13: board, bottom side, seen from below]

Size 43.67 x 25.91 mm. Coordinates in mm from the lower left corner, seen from the top.
Outline: 0,0 43.67,0 43.67,25.91 0,25.91 0,0
Copper layers (1*2*15*16): Top 0.035mm / dielectric 1.5mm / Route2 0.035mm / dielectric 0.15mm / Route15 0.035mm / dielectric 0.2mm / Bottom 0.035mm
Design rules "EagleRules *": minimum track width 7mil, minimum drill 12mil, track to track 7mil, track to pad 7mil, pad to pad 7mil, via to via 7mil, smd to smd 0mil, copper to edge 20mil, drill to drill 10mil, minimum pad ring 10mil, minimum via ring 6mil, stop-mask expansion 2mil, vias tented up to drill 25mil, thermal gap 10mil

### Footprints (pad centres in the part's own frame; a part is rotated, then mirrored left to right if it is on the bottom)
0402-CAP = smd 0.7 x 0.9: 1 -0.65,0; 2 0.65,0
C0603 = smd 1.1 x 1: 1 -0.85,0; 2 0.85,0
C0402 = smd 0.7 x 0.9: 1 -0.65,0; 2 0.65,0
SML0603 = smd 0.8 x 0.8: A 0.75,0; C -0.75,0
SOD-323 = smd 0.63 x 0.83: A 1.15,0; C -1.15,0
JST-2-SMD = smd 1 x 4.6: 1 -1,-3.7; 2 1,-3.7 | smd 1.6 x 3.4: NC1 -3.4,1.5; NC2 3.4,1.5
1X16 = drill 1.016 pad 1.88: 1 0,0; 2 2.54,0; 3 5.08,0; 4 7.62,0; 5 10.16,0; 6 12.7,0; 7 15.24,0; 8 17.78,0; 9 20.32,0; 10 22.86,0; 11 25.4,0; 12 27.94,0; 13 30.48,0; 14 33.02,0; 15 35.56,0; 16 38.1,0
0805 = smd 0.8 x 1.2: 1 -0.9,0; 2 0.9,0
0603 = smd 1.1 x 1: 1 -0.85,0; 2 0.85,0
0603-RES = smd 1.1 x 1: 1 -0.85,0; 2 0.85,0
0402 = smd 0.7 x 0.9: 1 -0.65,0; 2 0.65,0
R0402 = smd 0.7 x 0.9: 1 -0.65,0; 2 0.65,0
0402-RES = smd 0.7 x 0.9: 1 -0.65,0; 2 0.65,0
TACTILE_SWITCH_SMD = smd 1.25 x 0.65: 1 -1.875,0.775; 2 1.875,0.775; 3 -1.875,-0.775; 4 1.875,-0.775
LQFP-48 = smd 0.254 x 1.143: 1 -2.75,-4.25; 2 -2.25,-4.25; 3 -1.75,-4.25; 4 -1.25,-4.25; 5 -0.75,-4.25; 6 -0.25,-4.25; 7 0.25,-4.25; 8 0.75,-4.25; 9 1.25,-4.25; 10 1.75,-4.25; 11 2.25,-4.25; 12 2.75,-4.25; 25 2.75,4.25; 26 2.25,4.25; 27 1.75,4.25; 28 1.25,4.25; 29 0.75,4.25; 30 0.25,4.25; 31 -0.25,4.25; 32 -0.75,4.25; 33 -1.25,4.25; 34 -1.75,4.25; 35 -2.25,4.25; 36 -2.75,4.25 | smd 1.143 x 0.254: 13 4.25,-2.75; 14 4.25,-2.25; 15 4.25,-1.75; 16 4.25,-1.25; 17 4.25,-0.75; 18 4.25,-0.25; 19 4.25,0.25; 20 4.25,0.75; 21 4.25,1.25; 22 4.25,1.75; 23 4.25,2.25; 24 4.25,2.75; 37 -4.25,2.75; 38 -4.25,2.25; 39 -4.25,1.75; 40 -4.25,1.25; 41 -4.25,0.75; 42 -4.25,0.25; 43 -4.25,-0.25; 44 -4.25,-0.75; 45 -4.25,-1.25; 46 -4.25,-1.75; 47 -4.25,-2.25; 48 -4.25,-2.75
SOT95P270X145-5N = smd 1.321 x 0.559: 1 -1.372,0.94; 2 -1.372,0; 3 -1.372,-0.94; 4 1.372,-0.94; 5 1.372,0.94
SOT95P280X145-6N = smd 1.27 x 0.559: 1 -1.219,0.94; 2 -1.219,0; 3 -1.219,-0.94; 4 1.219,-0.94; 5 1.219,0; 6 1.219,0.94
CC3200 = smd 1 x 1: G00 -8.455,7; G01 -8.455,5; G02 -8.455,3; G03 -8.455,1; G04 -8.455,-1; G05 -8.455,-3; G06 -8.455,-5; G07 -8.455,-7; G08 -8.455,-9; G09 -8,-11; G10 -6,-11; G11 -4,-11; G12 -2,-11; G13 0,-11; G14 2,-11; G15 4,-11; G16 6,-11; G17 8,-11; G22 8.455,-1; G28 8.455,5; G30 -8.455,9; G31 -8.455,11; GND 8.455,11; RST 8.455,-7; SOP0 8.455,-5; SOP2 8.455,-3; TCK 8.455,7; TDI 8.455,1; TDO 8.455,3; TMS 8.455,9; VCC 8.455,-9
QFN20-4X4 = smd 0.73 x 0.3: 1 -1.965,1; 2 -1.965,0.5; 3 -1.965,0; 4 -1.965,-0.5; 5 -1.965,-1; 11 1.965,-1; 12 1.965,-0.5; 13 1.965,0; 14 1.965,0.5; 15 1.965,1 | smd 0.3 x 0.73: 6 -1,-1.965; 7 -0.5,-1.965; 8 0,-1.965; 9 0.5,-1.965; 10 1,-1.965; 16 1,1.965; 17 0.5,1.965; 18 0,1.965; 19 -0.5,1.965; 20 -1,1.965 | smd 2.5 x 2.5: 21 0,0
DECADE-SO-14 = smd 0.55 x 1.5: 1 -3.6,-2.88; 2 -2.33,-2.88; 3 -1.06,-2.88; 4 0.21,-2.88; 5 1.48,-2.88; 6 2.75,-2.88; 7 4.02,-2.88; 8 4.02,2.5; 9 2.75,2.5; 10 1.48,2.5; 11 0.21,2.5; 12 -1.06,2.5; 13 -2.33,2.5; 14 -3.6,2.5
ZX62R-B-5P = smd 1.35 x 0.4: 1 2.675,-1.3; 2 2.675,-0.65; 3 2.675,0; 4 2.675,0.65; 5 2.675,1.3 | smd 1.9 x 1.6: M1 0,-4.1; M2 0,4.1 | smd 2 x 2.1: M3 2.35,3.1; M4 2.35,-3.1
CRYSTAL_2.5X2 = smd 0.9 x 0.8: 1 -0.825,-0.625; 2 0.825,-0.625; 3 0.825,0.625; 4 -0.825,0.625

### Placement (x,y rotation side)
C1  34.7,17.61 270 top
C2  33.24,19.77 90 top
C3  19.81,18.3 270 top
C4  13.97,12.95 0 top
C5  10.41,4.57 0 top
C6  28.55,6.21 180 top
C7  17.02,6.35 270 top
CHRG  7.5,17.92 180 top
D3  16.76,9.91 270 top
DONE  7.48,16.32 180 top
J2  3.8,7.37 90 top
JP1  3.43,24.31 0 top
JP2  41.53,1.52 180 top
L1  14.48,3.81 0 top
L3  23.86,17.14 0 top
PWR  7.52,14.52 180 top
R1  19.87,10.83 270 top
R2  11.94,21.59 270 top
R3  11.18,10.67 270 top
R4  14.22,6.6 180 top
R5  9.14,10.67 270 top
R6  31.68,19.84 270 top
R7  20.02,6.98 90 top
R8  11.18,7.37 90 top
R9  18.26,21.43 90 top
R10  14.65,21.98 0 top
R11  10.16,16.26 0 top
R12  10.16,14.48 0 top
R13  14.48,5.33 0 top
R14  22.2,9.61 90 top
R15  17.09,12.88 0 top
R16  8.13,22.35 180 top
R17  30.33,19.84 270 top
R18  32.09,6.35 180 top
R19  37.43,6.3 90 top
R20  38.98,6.25 270 top
R21  42.23,18.65 270 top
R22  40.83,18.6 270 top
R23  23.99,7.83 270 top
R24  35.83,6.35 270 top
R25  27.67,19.94 270 top
R26  22.68,13.5 180 top
R27  26.18,19.94 90 top
R28  22.63,14.85 0 top
R29  22.68,12.1 180 top
R30  35.91,19.48 270 top
R31  24.62,20.03 90 top
R32  29.03,19.84 90 top
R33  25.5,7.89 90 top
R34  40.78,6.25 90 top
R35  10.16,18.03 0 top
S1  8.38,20.07 180 top
THERMAL  19.9,14.37 270 top
U2  29.7,12.81 270 top
U3  14.22,9.4 270 top
U5  38.26,18.97 270 top
U$1  31.5,12.7 90 bottom
U$3  15.13,17.34 90 top
U$4  39.12,12.34 90 top
USB  1.5,17.52 0 top
Y1  22.35,19.56 0 top

### Tracks (layer width: path | path; a pad name or v marks a point on that pad's centre or on a via)
+5V_USB  (via drill 0.3)
  Top 0.178: U$3.3 15.2,15.38 15.56,15.38 U$3.4 15.65,15.29 15.65,14.94 16.54,14.05 18.22,14.05 19.11,13.16 19.11,12.8 19.38,12.54 20.45,12.54 20.49,12.49 | 20.49,12.49 21.34,11.65 21.34,11.29 22.14,10.49 R14.2 | 20.49,12.49 20.71,12.71 20.71,15.11 22.67,17.07 22.94,17.07 L3.1 23.02,17.16 23.2,17.16 24.18,18.14 v24.54,18.14 | v26.85,13.78 26.67,13.78 26.4,14.05 25.51,14.05 U2.4 | 10.85,17.69 10.85,17.96 R35.2 10.85,17.69 | 10.85,17.69 10.85,16.27 R11.2 | 13.25,17.69 13.25,17.42 U$3.18 13.25,17.34 13.25,16.89 U$3.19 13.16,16.8 12.71,16.8 12.54,16.62 12.54,16.18 10.85,14.49 R12.2 10.85,14.4 11.82,13.42 11.82,12.71 11.47,12.36 10.58,12.36 10.4,12.18 10.4,10.85 10.54,10.71 | 13.25,17.69 13.25,17.78 U$3.17 13.25,17.69 | v16.27,20.18 17.78,18.67 17.78,18.05 17.6,17.87 17.16,17.87 U$3.9 | 13.25,17.69 v12.18,17.69 10.85,17.69 | 10.54,10.71 11.11,10.13 11.11,9.87 R3.2 | USB.1 4.18,16.18 4.53,16.18 5.16,15.56 5.16,14.05 8.53,10.67 10.49,10.67 10.54,10.71
  Route15 0.178: v24.54,18.14 22.67,18.14 20.62,20.18 v16.27,20.18
  Bottom 0.178: v26.85,13.78 26.67,13.78 24.54,15.91 v24.54,18.14 | v16.27,20.18 15.02,20.18 12.54,17.69 v12.18,17.69
+5V_USB_F  (via drill 0.3)
  Top 0.178: L3.2 24.62,17.07 24.62,15.82 24.54,15.73 24.54,14.85 24.8,14.58 25.43,14.58 U2.3 25.51,14.58 v26.76,14.58 | 30.23,16.18 32.72,16.18 32.89,16.36 32.89,17.78 32.45,18.22 32.45,19.65 32.27,19.82 28.45,19.82 27.74,20.54 R25.1 | 30.23,16.18 29.96,16.45 29.96,16.98 U2.42 | 30.23,16.18 v29.07,15.02
  Bottom 0.178: v26.76,14.58 28.63,14.58 v29.07,15.02
+BATT  (via drill 0.3)
  Top 0.178: v12.27,18.49 12.36,18.4 13.16,18.4 U$3.16 | v14.13,20.18 14.13,19.38 U$3.15 14.22,19.38 14.58,19.38 U$3.14 | v18.85,11.91 18.85,11.2 19.82,10.22 19.82,10.05 R1.2 | v10.13,9.25 9.34,8.45 7.56,8.45 J2.2
  Route15 0.178: v12.27,18.49 15.82,14.94 | 15.82,14.94 v18.85,11.91 | 15.82,14.94 v10.13,9.25
  Bottom 0.178: v12.27,18.49 12.45,18.49 v14.13,20.18
DBG_RST_N  (via drill 0.3)
  Top 0.178: R19.1 37.43,5.69 35.92,5.69 R24.2 35.74,5.69 35.56,5.69 v34.94,6.31 | v38.94,10.31 39.56,10.31 41.78,12.54 41.96,12.54 U$4.4
  Bottom 0.178: v38.94,10.31 v34.94,6.31
DBGEN_N
  Top 0.178: R18.1 32.8,6.31 33.96,6.31 35.29,4.98 39.56,4.98 40.01,5.42 40.01,6.04 40.18,6.22 41.34,6.22 41.96,6.84 41.96,8.71 U$4.1
FB  (via drill 0.3)
  Top 0.178: 11.69,8.31 13.25,9.87 13.25,10.76 U3.3 | 11.69,8.31 11.47,8.09 11.2,8.09 R8.2 | R13.1 13.6,5.33 v12.71,6.22 | 11.69,8.31 v12.45,7.56
  Bottom 0.178: v12.71,6.22 12.71,7.29 v12.45,7.56
FT_SK
  Top 0.178: R20.1 39.03,6.93 39.03,7.47 41.52,9.96 41.96,9.96 U$4.2
FTDI_RX  (via drill 0.3)
  Top 0.178: v31.91,22.23 31.74,22.05 31.74,20.54 R6.1
  Route2 0.178: v31.91,22.23 31.91,3.56 33.87,1.6 JP2.4
  Bottom 0.178: U$1.G01 36.45,4.18 33.87,1.6 JP2.4
FTDI_TX  (via drill 0.3)
  Top 0.178: v30.14,22.23 30.32,22.05 30.32,20.54 R17.1
  Route15 0.178: v30.14,22.23 30.14,21.16 26.94,17.96 26.94,16.45 26.14,15.65 26.14,6.76 JP2.5
  Bottom 0.178: U$1.G02 34.49,4.18 33.96,4.18 31.38,1.6 JP2.5
G00
  Bottom 0.178: U$1.G00 38.49,4.18 38.49,3.65 36.45,1.6 JP2.3
GND  (via drill 0.3)
  Top 0.178: 11.2,6.31 11.2,4.62 C5.2 | 11.2,6.31 11.2,6.67 R8.1 | 9.78,6.31 7.56,6.31 J2.1 9.78,6.31 | 9.78,6.31 11.2,6.31 | R9.1 18.22,20.54 19.74,19.02 C3.1 19.74,18.94 19.02,18.22 19.02,18.05 | 19.02,18.05 19.02,17.25 19.82,16.45 19.82,15.29 THERMAL.1 | 16.58,18.89 16.18,19.29 U$3.11 | 16.58,18.89 17.07,18.4 U$3.10 | 16.58,18.89 15.11,17.42 U$3.21 15.02,17.42 12.98,19.47 v12.54,19.47 | 12.89,22.23 13.6,22.23 13.78,22.05 R10.1 | 12.89,22.23 12,22.23 R2.1 11.91,22.31 8.8,22.31 R16.1 8.71,22.31 7.91,23.11 7.02,23.11 5.6,21.69 5.6,19.91 4.53,18.85 4.18,18.85 USB.5 | 12.89,22.23 v12.89,22.85 | v18.76,18.05 19.02,18.05 | v9.78,7.38 9.78,6.31 | U3.2 14.22,12.18 14.85,12.8 C4.2 14.85,12.89 16.18,12.89 R15.1 16.27,12.8 17.29,11.78 | 17.47,8.67 17.96,8.18 17.96,6.67 17.91,6.62 | 17.47,8.67 17.42,8.71 16.8,8.71 D3.A | 17.91,6.62 17.07,5.78 C7.2 | 17.91,6.62 18.4,6.13 20,6.13 R7.1 20,6.22 21.43,7.64 21.43,9.42 21.6,9.6 22.85,9.6 24.8,11.56 25.43,11.56 U2.9 25.51,11.56 27.29,11.56 27.34,11.51 | 17.29,11.78 17.51,11.56 17.51,8.71 17.47,8.67 | 34,18.36 34.05,18.31 34.67,18.31 C1.1 | 34,18.36 C2.1 33.25,19.2 35.2,21.16 38.32,21.16 38.36,21.11 | 33.12,14.8 33.07,14.85 33.07,16 33.96,16.89 33.96,18.31 34,18.36 | 33.12,14.8 33.34,14.58 33.87,14.58 U2.34 | 28.23,16.22 28.45,16.45 U2.45 | 28.23,16.22 28.18,16.18 27.74,16.18 27.47,16.45 27.47,16.98 U2.47 | 29.56,9.29 30.32,10.05 33.87,10.05 U2.25 | 29.56,9.29 29.52,9.25 29.52,8.62 U2.18 | 29.56,9.29 27.34,11.51 | 28.94,14.27 28.98,14.22 28.98,13.16 27.34,11.51 | 28.94,14.27 28.27,14.94 28.27,16.18 28.23,16.22 | 33.12,14.8 33.07,14.76 29.69,14.76 29.25,14.31 28.98,14.31 28.94,14.27
  Top 0.178: U$4.7 41.96,16.45 40.72,16.45 40.36,16.8 40.36,17.42 40.8,17.87 R22.2 40.89,17.96 41.6,18.67 42.85,18.67 43.03,18.85 43.03,19.82 40.05,22.8 | 40.05,22.8 41.52,24.27 JP1.16 | 40.05,22.8 38.36,21.11 | 38.36,21.11 38.32,21.07 38.32,20.27 U5.2 | v30.05,6.22 29.25,6.22 C6.1 | v17.42,11.82 17.34,11.82 17.29,11.78
  Route2 0.178: v18.76,18.05 13.96,18.05 v12.54,19.47
  Bottom 0.178: v12.54,19.47 12.54,22.49 v12.89,22.85 | v9.78,7.38 9.78,8 11.2,9.42 11.2,10.13 12.36,11.29 17.42,11.29 | 17.42,11.29 19.65,11.29 20.27,11.91 21.16,11.91 21.34,12.09 21.34,17.25 20.71,17.87 18.94,17.87 v18.76,18.05 | v30.05,6.22 33.69,6.22 42.49,15.02 42.49,21.07 U$1.GND 41.6,22.05 41.6,24.27 JP1.16 | v17.42,11.82 17.42,11.29
GPIO_05
  Top 0.178: R7.2 20.09,7.91 20.09,8.71 20.71,9.34 20.71,10.85 19.91,11.65 R1.1
N$1
  Top 0.178: 7.42,21.74 6.58,20.89 S1.4 | 7.42,21.74 7.47,21.78 7.47,22.31 R16.2 | 7.42,21.74 8.27,20.89 10.22,20.89 S1.3
N$2
  Bottom 0.178: U$1.TMS 40.45,21.16 40.45,22.85 39.03,24.27 JP1.15
N$3
  Bottom 0.178: U$1.TCK 38.49,22.23 36.45,24.27 JP1.14
N$4
  Bottom 0.178: U$1.G28 36.45,21.16 36.45,21.78 33.96,24.27 JP1.13
N$5
  Bottom 0.178: U$1.TDO 31.38,24.27 JP1.12
N$6
  Bottom 0.178: U$1.TDI 32.45,21.16 32.09,21.16 28.89,24.36 JP1.11
N$7
  Bottom 0.178: U$1.G22 29.87,21.16 26.76,24.27 26.31,24.27 JP1.10
N$8
  Top 0.178: R26.1 23.38,13.51 25.43,13.51 U2.5
N$9
  Bottom 0.178: U$1.SOP0 25.96,21.16 24.09,23.02 22.49,23.02 21.25,24.27 JP1.8
N$11
  Top 0.178: R4.1 14.85,6.67 13.51,8 13.34,8 U3.4
N$12
  Bottom 0.178: JP2.1 42.49,2.49 42.49,4.18 U$1.G31
N$13
  Bottom 0.178: U$1.G30 40.45,4.18 40.45,3.02 39.03,1.6 JP2.2
N$17
  Bottom 0.178: U$1.G03 32.45,4.18 31.83,4.18 29.25,1.6 28.89,1.6 JP2.6
N$18
  Bottom 0.178: U$1.G04 30.49,4.18 29.87,4.18 28.45,2.76 27.47,2.76 26.31,1.6 JP2.7
N$19
  Bottom 0.178: JP2.8 24.98,2.76 26.4,2.76 27.83,4.18 28.45,4.18 U$1.G05
N$20
  Bottom 0.178: U$1.G06 26.49,4.18 25.87,4.18 24.45,2.76 22.94,2.76 21.78,1.6 21.25,1.6 JP2.9
N$21
  Bottom 0.178: U$1.G07 24.45,4.18 23.82,4.18 22.4,2.76 19.82,2.76 18.67,1.6 JP2.10
N$22
  Bottom 0.178: U$1.G08 22.49,4.18 21.96,4.18 20.89,3.11 17.69,3.11 16.18,1.6 JP2.11
N$23
  Bottom 0.178: U$1.G09 20.45,4.62 15.11,4.62 14.67,4.18 14.22,4.18 13.6,3.56 13.6,1.6 JP2.12
N$24
  Bottom 0.178: U$1.G17 20.45,20.71 18.67,20.71 16.36,23.02 14.85,23.02 13.6,24.27 JP1.5
N$25
  Bottom 0.178: U$1.G10 20.45,6.67 16.62,6.67 14.49,4.53 14.05,4.53 11.11,1.6 JP2.13
N$26
  Bottom 0.178: U$1.G11 20.45,8.62 12.62,8.62 8.53,4.53 8.53,1.6 JP2.14
N$27
  Bottom 0.178: U$1.G12 20.45,10.67 12.27,10.67 11.56,9.96 11.56,8.09 6.04,2.58 6.04,1.6 JP2.15
N$28
  Bottom 0.178: U$1.G13 20.45,12.62 12.62,12.62 3.47,3.47 3.47,1.6 JP2.16
N$29
  Bottom 0.178: U$1.G16 20.45,18.67 15.02,18.67 12.18,15.82 11.65,15.82 11.11,16.36 11.11,24.27 JP1.4
N$30
  Bottom 0.178: U$1.G15 20.45,16.71 13.6,16.71 12.36,15.47 11.47,15.47 10.76,16.18 10.76,22.05 8.53,24.27 JP1.3
N$31
  Bottom 0.178: U$1.G14 20.45,14.76 18.49,14.76 17.07,16.18 13.6,16.18 12.54,15.11 11.29,15.11 6.04,20.36 6.04,24.27 JP1.2
N$38  (via drill 0.3)
  Top 0.178: v25.87,18.4 25.43,18.85 25.43,19.82 25.25,20 24.09,20 23.91,20.18 23.2,20.18 Y1.3 | v28.27,18.4 28.71,18.4 29.43,17.69 29.43,17.07 U2.43 | v34.14,22.4 33.25,21.51 33.25,20.45 C2.2
  Route15 0.178: v34.14,22.4 32.98,22.4 29.52,18.94 28.8,18.94 v28.27,18.4
  Bottom 0.178: v28.27,18.4 v25.87,18.4
N$39  (via drill 0.3)
  Top 0.178: 26.94,17.51 26.94,17.07 U2.48 26.94,17.51 | 26.94,17.51 26.94,18.22 26.23,18.94 26.23,19.2 R27.1 | v37.87,18.94 38.23,18.58 38.23,17.78 U5.5 | 26.94,17.51 v26.31,17.51
  Route2 0.178: v37.87,18.94 36.72,18.94 32.8,22.85 31.65,22.85 v26.31,17.51
N$40  (via drill 0.3)
  Top 0.178: C3.2 19.82,17.69 20.36,17.69 21.51,18.85 Y1.1 21.34,18.58 v21.96,17.96 | v28.89,15.82 28.89,16.98 U2.44
  Route2 0.178: v28.89,15.82 28.09,15.82 27.03,16.89 23.02,16.89 v21.96,17.96
N$41  (via drill 0.3)
  Top 0.178: 35.92,20.09 37.25,18.76 37.25,17.78 U5.4 | v27.2,15.82 26.94,15.56 25.51,15.56 U2.1 | v34.23,19.11 34.94,19.11 35.92,20.09 | 35.92,20.09 R30.1
  Route15 0.178: v27.2,15.82 28,15.82 29.87,17.69 32.8,17.69 v34.23,19.11
N$42  (via drill 0.3)
  Top 0.178: v29.69,18.31 29.07,18.94 29.07,19.11 R32.1 | v28.36,13.96 27.11,15.2 26.23,15.2 26.14,15.11 25.51,15.11 U2.2 | v34.85,19.91 34.85,20.27 35.38,20.8 36.45,20.8 36.98,20.27 37.25,20.27 U5.3
  Bottom 0.178: v28.36,13.96 28.89,13.96 29.69,14.76 v29.69,18.31 31.29,19.91 v34.85,19.91
N$43  (via drill 0.3)
  Top 0.178: v35.56,17.6 34.94,16.98 34.76,16.98 C1.2 | v27.83,13.34 27.29,13.34 27.03,13.07 25.51,13.07 U2.6
  Bottom 0.178: v35.56,17.6 33.07,17.6 28.8,13.34 v27.83,13.34
N$44
  Top 0.178: R17.2 30.4,19.11 30.4,18.22 30.94,17.69 30.94,17.07 U2.40
N$45
  Top 0.178: R6.2 31.65,19.11 31.65,17.87 31.47,17.69 31.47,17.07 U2.39
N$46
  Top 0.178: R20.2 38.94,5.69 38.58,5.69 37.96,6.31 36.8,6.31 36.63,6.49 36.63,7.47 35.92,8.18 32.8,8.18 32.45,8.53 U2.24
N$47
  Top 0.178: R19.2 37.52,7.02 37.52,8.18 37.69,8.36 37.69,9.16 37.43,9.42 30.23,9.42 29.96,9.16 29.96,8.62 U2.19
N$48
  Top 0.178: R18.2 31.38,6.4 30.76,6.4 29.52,7.64 29.25,7.64 28.98,7.91 28.98,8.53 U2.17
N$49
  Top 0.178: R22.1 40.8,19.2 40.01,18.4 40.01,15.65 41.78,13.87 41.96,13.87 U$4.5
N$50  (via drill 0.3)
  Top 0.178: v41.52,20.09 42.23,19.38 R21.1 | v40.89,15.73 41.34,15.73 41.96,15.11 U$4.6
  Bottom 0.178: v41.52,20.09 41.52,17.42 41.6,17.34 41.6,16.45 v40.89,15.73
N$51  (via drill 0.3)
  Top 0.178: U2.46 27.91,17.07 27.91,17.69 27.65,17.96 27.65,19.2 R25.2 27.65,19.29 26.94,20 26.94,21.07 26.14,21.87 v23.47,21.87 | v27.83,7.47 27.83,6.22 C6.2
  Route2 0.178: v27.83,7.47 27.83,8.36 21.34,14.85 21.34,19.74 v23.47,21.87
N$54  (via drill 0.3)
  Top 0.178: 28.23,21.29 28.98,20.54 R32.2 | 28.23,21.29 27.03,22.49 21.51,22.49 20.8,21.78 20.8,21.25 21.16,20.89 22.05,20.89 22.31,20.62 22.31,18.49 22.58,18.22 23.74,18.22 24.54,19.02 24.54,19.38 R31.1 | v39.12,19.02 39.12,20.18 U5.1 | v36.89,22.23 35.2,22.23 34.4,23.02 29.96,23.02 28.23,21.29
  Bottom 0.178: v39.12,19.02 37.34,20.8 37.34,21.78 v36.89,22.23
N$55
  Top 0.178: R33.2 25.51,8.62 25.51,8.98 26.31,9.78 26.31,10.85 26.14,11.02 25.51,11.02 U2.10
N$56  (via drill 0.3)
  Top 0.178: v40.27,7.82 40.72,7.38 40.72,6.93 R34.2 | v39.38,8.71 37.52,10.58 33.96,10.58 U2.26
  Bottom 0.178: v39.38,8.71 v40.27,7.82
N$68  (via drill 0.3)
  Top 0.178: v15.73,20.8 15.65,20.71 15.65,19.38 U$3.12 | v17.25,21.25 18.22,22.23 R9.2
  Bottom 0.178: v15.73,20.8 16.8,20.8 v17.25,21.25
N$69
  Top 0.178: U$3.13 15.11,19.38 15.11,21.6 15.47,21.96 R10.2
N$70  (via drill 0.3)
  Top 0.178: v16.8,15.56 17.07,15.82 17.07,16.27 U$3.6 | v10.13,13.6 7.73,13.6 6.84,14.49 PWR.A
  Bottom 0.178: v16.8,15.56 13.78,15.56 11.82,13.6 v10.13,13.6
N$71  (via drill 0.3)
  Top 0.178: v18.05,16.09 18.05,16.36 17.6,16.8 17.16,16.8 U$3.7 | v10.13,17.16 7.56,17.16 6.76,16.36 DONE.A
  Route2 0.178: v18.05,16.09 17.16,16.09 16.18,17.07 10.22,17.07 v10.13,17.16
N$72
  Top 0.178: U$3.8 17.16,17.34 17.6,17.34 18.14,17.87 18.14,19.2 16.36,20.98 16.36,22.58 16.18,22.76 14.85,22.76 14.67,22.58 14.67,21.34 14.13,20.8 13.87,20.8 13.16,20.09 8.89,20.09 6.76,17.96 CHRG.A
N$73
  Top 0.178: CHRG.C 8.27,17.96 9.42,17.96 R35.1
N$74
  Top 0.178: DONE.C 8.27,16.27 9.42,16.27 R11.1
N$75
  Top 0.178: PWR.C 8.36,14.49 9.42,14.49 R12.1
N$76  (via drill 0.3)
  Top 0.178: U$3.2 14.67,15.29 14.67,14.94 15.91,13.69 17.07,13.69 17.87,12.89 R15.2 17.96,12.8 18.05,12.71 18.05,11.47 18.85,10.67 v18.85,10.05 | v22.05,7.64 22.14,7.73 22.14,8.71 R14.1
  Route2 0.178: v22.05,7.64 21.25,7.64 v18.85,10.05
N$77
  Top 0.178: U$3.5 16.18,15.29 17.07,14.4 19.02,14.4 19.82,13.6 THERMAL.2
OUT  (via drill 0.3)
  Top 0.178: U$3.20 13.25,16.27 U$3.1 14.05,15.29 14.05,13.87 13.16,12.98 C4.1 13.07,12.89 11.47,11.29 R3.1 11.2,11.47 12,10.67 12,9.69 | 12,9.69 12,9.16 11.82,8.98 10.94,8.98 10.4,8.45 10.4,7.56 10.58,7.38 11.73,7.38 12.18,6.93 12.89,6.93 13.16,6.67 13.51,6.67 R4.2 | v13.96,9.25 15.11,8.09 U3.5 | 12,9.69 v12.18,9.69
  Bottom 0.178: v13.96,9.25 12.62,9.25 v12.18,9.69
RST  (via drill 0.3)
  Top 0.178: v9.07,12.18 9.07,11.38 R5.1 | v5.78,17.42 5.78,18.49 6.49,19.2 S1.2 | v40.98,17.07 41.16,17.07 42.05,17.96 42.23,17.96 R21.2
  Route15 0.178: v5.78,17.42 8.71,17.42 14.49,23.2 17.6,23.2 18.67,24.27 JP1.7
  Bottom 0.178: v9.07,12.18 9.07,14.13 v5.78,17.42 | v40.98,17.07 35.92,17.07 31.56,12.71 27.03,12.71 23.91,15.82 23.91,20.54 24.45,21.07 U$1.RST 24.45,21.16 24.45,21.78 23.74,22.49 21.25,22.49 19.47,24.27 18.67,24.27 JP1.7
SOP2  (via drill 0.3)
  Top 0.178: v24.36,10.22 23.2,9.07 23.2,7.91 23.91,7.2 R23.2 | v13.16,20.98 12,20.98 R2.2
  Route15 0.178: v24.36,10.22 24.36,12.18 25.51,13.34 v25.51,16.18 25.25,16.45 19.11,16.45 14.58,20.98 v13.16,20.98
  Bottom 0.178: v25.51,16.18 25.51,17.87 25.25,18.14 25.25,18.67 26.94,20.36 27.74,20.36 28.45,21.07 U$1.SOP2
SW
  Top 0.178: 16,11.02 15.38,11.02 15.2,10.85 U3.1 | 16,11.02 16.71,11.02 D3.C | 16,11.02 16,8.36 16.09,8.27 16.09,3.11 15.91,2.93 14.22,2.93 13.6,3.56 13.6,3.73 L1.1
TCK
  Top 0.178: R23.1 24,8.45 24.71,7.73 24.71,6.76 26.85,4.62 40.98,4.62 43.03,6.67 43.03,10.4 42.23,11.2 42.05,11.2 U$4.3
USB_D+  (via drill 0.3)
  Top 0.178: v24.18,14.13 23.47,14.85 23.29,14.85 R28.2 | v11.91,16.45 11.91,16.18 11.2,15.47 6.4,15.47 5.87,16 5.87,16.45 4.8,17.51 USB.3
  Bottom 0.178: v24.18,14.13 24.18,14.49 22.94,15.73 22.94,17.87 21.34,19.47 14.94,19.47 v11.91,16.45
USB_D-  (via drill 0.3)
  Top 0.178: v23.2,11.11 23.02,11.11 22.05,12.09 R29.2 | v11.2,12.98 7.11,12.98 5.51,14.58 5.51,16.18 4.89,16.8 4.18,16.8 USB.2
  Route2 0.178: v23.2,11.11 13.07,11.11 v11.2,12.98
USB_DM
  Top 0.178: R29.1 23.38,12.09 25.43,12.09 U2.8
USB_DP  (via drill 0.3)
  Top 0.178: R26.2 22.05,13.51 22.05,14.85 R28.1 22.05,14.94 22.31,15.2 v22.31,15.82 | v24.18,12.89 24.45,12.62 25.43,12.62 U2.7
  Bottom 0.178: v24.18,12.89 24.18,13.25 22.31,15.11 v22.31,15.82
VCC  (via drill 0.3)
  Top 0.178: 26.98,7.51 27.38,7.91 27.38,8.53 U2.14 | 26.98,7.51 26.8,7.33 | 26.8,7.33 26.76,7.29 25.51,7.29 R33.1 | R24.1 35.83,7.02 33.25,7.02 33.16,7.11 32.27,7.11 32.09,6.93 32.09,5.78 31.74,5.42 27.47,5.42 26.85,6.04 26.85,7.29 26.8,7.33 | 35.47,15.73 35.47,13.96 34.63,13.11 | 35.47,15.73 35.47,16.62 36.18,17.34 36.18,17.87 35.92,18.14 35.92,18.76 R30.2 | 34.63,13.11 34.58,13.07 U2.31 | 35.47,15.73 37.6,15.73 39.12,17.25 39.12,17.69 U5.6 | R5.2 9.07,9.96 5.87,9.96 4.89,8.98 4.89,5.78 6.04,4.62 9.51,4.62 C5.1 9.6,4.62 v10.58,5.6 | R13.2 15.2,5.33 15.2,3.91 15.29,3.82 L1.2 15.2,3.82 14.76,3.82 v14.49,3.56 | R27.2 26.14,20.62 24.62,20.62 R31.2 24.54,20.71 23.91,20.71 23.38,21.25 21.69,21.25 v21.43,21.51 | v17.34,7.91 17.07,7.64 17.07,7.02 C7.1 | v35.38,8.8 36.54,8.8 U$4.14 | v35.03,12.71 34.63,13.11 | v27.03,7.47 26.98,7.51
  Bottom 0.178: 24.76,11.51 24.8,11.56 24.8,14.4 23.29,15.91 23.29,20.36 22.58,21.07 U$1.VCC 22.14,21.51 v21.43,21.51 19.74,21.51 16.98,24.27 16.18,24.27 JP1.6 | 24.76,11.51 21.29,8.04 | 21.29,8.04 21.16,7.91 v17.34,7.91 15.02,5.6 v10.58,5.6 | 35.03,8.8 27.47,8.8 27.43,8.85 | 35.03,8.8 v35.38,8.8 | 24.76,11.51 27.43,8.85 | v14.49,3.56 20.8,3.56 21.34,4.09 21.34,8 21.29,8.04 | 35.03,8.8 v35.03,12.71 | v27.03,7.47 27.03,8.45 27.43,8.85